# Altium project Mercury_AD_BaseBoard.PrjPcb (part 2 of 4)

## Sheet LTC2666-16.SchDoc
size A; SheetNumber: 20; SheetTotal: 24
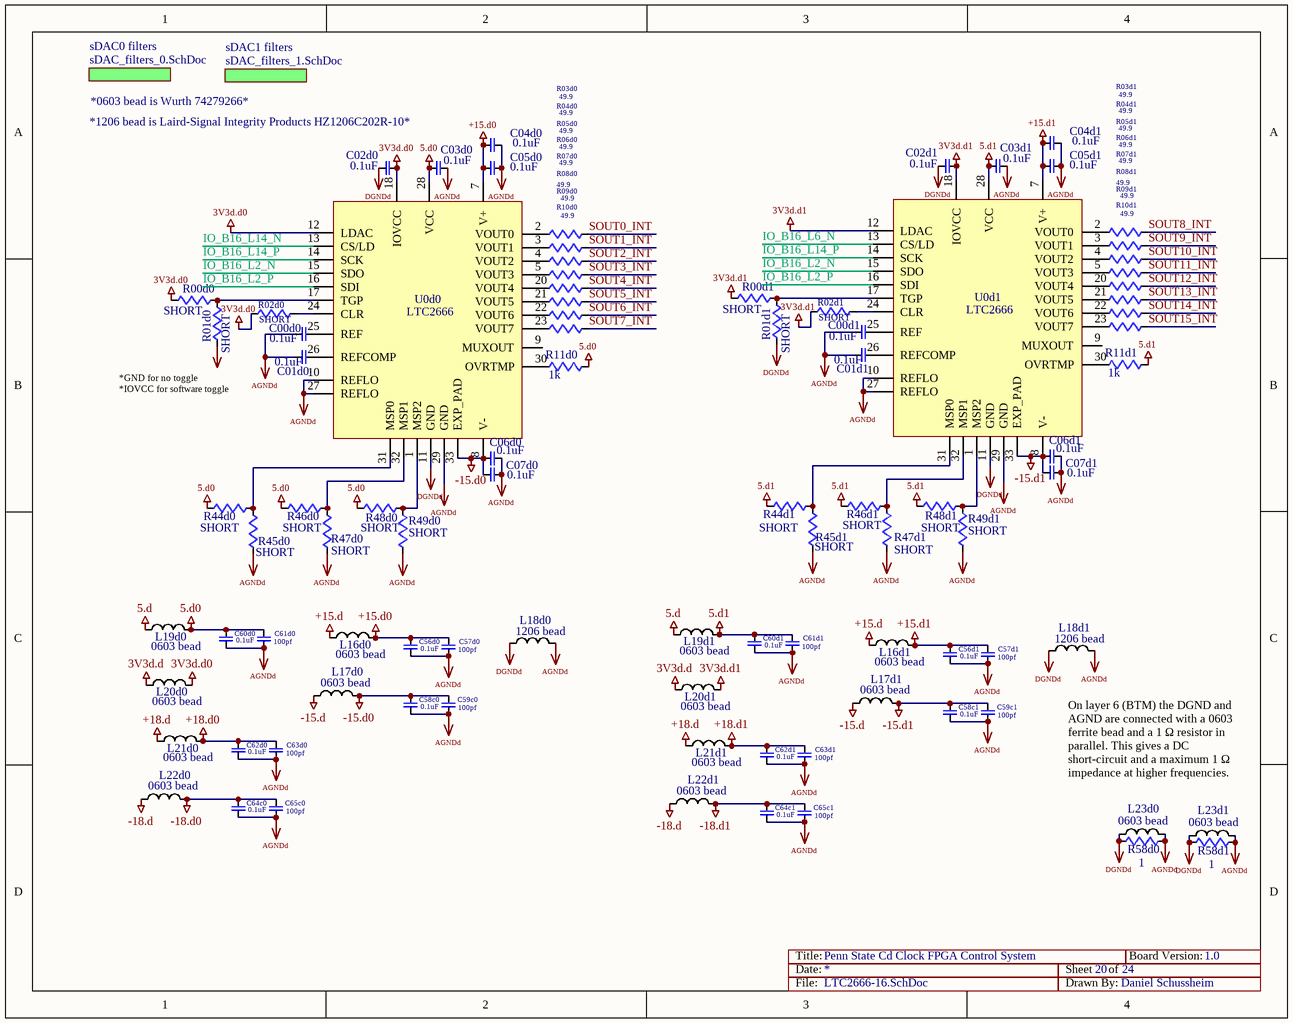
[diagram p9: LTC2666-16.SchDoc]

### Parts
C00d0  0.1uF  [0603]
C00d1  0.1uF  [0603]
C01d0  0.1uF  [0603]
C01d1  0.1uF  [0603]
C02d0  0.1uF  [0603]
C02d1  0.1uF  [0603]
C03d0  0.1uF  [0603]
C03d1  0.1uF  [0603]
C04d0  0.1uF  [0603]
C04d1  0.1uF  [0603]
C05d0  0.1uF  [0603]
C05d1  0.1uF  [0603]
C06d0  0.1uF  [0603]
C06d1  0.1uF  [0603]
C07d0  0.1uF  [0603]
C07d1  0.1uF  [0603]
C56d0  0.1uF  [0603]
C56d1  0.1uF  [0603]
C57d0  100pf  [0603]
C57d1  100pf  [0603]
C58c0  0.1uF  [0603]
C58c1  0.1uF  [0603]
C59c0  100pf  [0603]
C59c1  100pf  [0603]
C60d0  0.1uF  [0603]
C60d1  0.1uF  [0603]
C61d0  100pf  [0603]
C61d1  100pf  [0603]
C62d0  0.1uF  [0603]
C62d1  0.1uF  [0603]
C63d0  100pf  [0603]
C63d1  100pf  [0603]
C64c0  0.1uF  [0603]
C64c1  0.1uF  [0603]
C65c0  100pf  [0603]
C65c1  100pf  [0603]
L16d0  0603 bead  [0603]
L16d1  0603 bead  [0603]
L17d0  0603 bead  [0603]
L17d1  0603 bead  [0603]
L18d0  1206 bead  [1206]
L18d1  1206 bead  [1206]
L19d0  0603 bead  [0603]
L19d1  0603 bead  [0603]
L20d0  0603 bead  [0603]
L20d1  0603 bead  [0603]
L21d0  0603 bead  [0603]
L21d1  0603 bead  [0603]
L22d0  0603 bead  [0603]
L22d1  0603 bead  [0603]
L23d0  0603 bead  [0603]
L23d1  0603 bead  [0603]
R00d0  SHORT  [0603]
R00d1  SHORT  [0603]
R01d0  SHORT  [0603]
R01d1  SHORT  [0603]
R02d0  SHORT  [0603]
R02d1  SHORT  [0603]
R03d0  49.9  [0603]
R03d1  49.9  [0603]
R04d0  49.9  [0603]
R04d1  49.9  [0603]
R05d0  49.9  [0603]
R05d1  49.9  [0603]
R06d0  49.9  [0603]
R06d1  49.9  [0603]
R07d0  49.9  [0603]
R07d1  49.9  [0603]
R08d0  49.9  [0603]
R08d1  49.9  [0603]
R09d0  49.9  [0603]
R09d1  49.9  [0603]
R10d0  49.9  [0603]
R10d1  49.9  [0603]
R11d0  1k  [0603]
R11d1  1k  [0603]
R44d0  SHORT  [0603]
R44d1  SHORT  [0603]
R45d0  SHORT  [0603]
R45d1  SHORT  [0603]
R46d0  SHORT  [0603]
R46d1  SHORT  [0603]
R47d0  SHORT  [0603]
R47d1  SHORT  [0603]
R48d0  SHORT  [0603]
R48d1  SHORT  [0603]
R49d0  SHORT  [0603]
R49d1  SHORT  [0603]
R58d0  1  [0603]
R58d1  1  [0603]
U0d0  LTC2666  [32QFN]
U0d1  LTC2666  [32QFN]

### Sub-sheets
sDAC0 filters = sDAC_filters_0.SchDoc: no entries
sDAC1 filters = sDAC_filters_1.SchDoc: no entries

### Nets
3V3d.d: L20d0.1 L20d1.1
3V3d.d0: C02d0.1 L20d0.2 R00d0.2 R02d0.2 U0d0.12(LDAC) U0d0.18(IOVCC)
3V3d.d1: C02d1.1 L20d1.2 R00d1.2 R02d1.2 U0d1.12(LDAC) U0d1.18(IOVCC)
5.d: L19d0.1 L19d1.1
5.d0: C03d0.2 C60d0.1 C61d0.1 L19d0.2 R11d0.2 R44d0.2 R46d0.2 R48d0.2 U0d0.28(VCC)
5.d1: C03d1.2 C60d1.1 C61d1.1 L19d1.2 R11d1.2 R44d1.2 R46d1.2 R48d1.2 U0d1.28(VCC)
+15.d: L16d0.1 L16d1.1
+15.d0: C04d0.2 C05d0.2 C56d0.1 C57d0.1 L16d0.2 U0d0.7(V+)
+15.d1: C04d1.2 C05d1.2 C56d1.1 C57d1.1 L16d1.2 U0d1.7(V+)
+18.d: L21d0.1 L21d1.1
+18.d0: C62d0.1 C63d0.1 L21d0.2
+18.d1: C62d1.1 C63d1.1 L21d1.2
-15.d: L17d0.1 L17d1.1
-15.d0: C06d0.2 C07d0.2 C58c0.1 C59c0.1 L17d0.2 U0d0.8(V-) U0d0.33(EXP_PAD)
-15.d1: C06d1.2 C07d1.2 C58c1.1 C59c1.1 L17d1.2 U0d1.8(V-) U0d1.33(EXP_PAD)
-18.d: L22d0.1 L22d1.1
-18.d0: C64c0.1 C65c0.1 L22d0.2
-18.d1: C64c1.1 C65c1.1 L22d1.2
AGNDd: C00d0.2 C00d1.2 C01d0.2 C01d1.2 C02d0.2 C02d1.2 C03d0.1 C03d1.1 C04d0.1 C04d1.1 C05d0.1 C05d1.1 C06d0.1 C06d1.1 C07d0.1 C07d1.1 C56d0.2 C56d1.2 C57d0.2 C57d1.2 C58c0.2 C58c1.2 C59c0.2 C59c1.2 C60d0.2 C60d1.2 C61d0.2 C61d1.2 C62d0.2 C62d1.2 C63d0.2 C63d1.2 C64c0.2 C64c1.2 C65c0.2 C65c1.2 L18d0.1 L18d0.2 L18d1.1 L18d1.2 L23d0.1 L23d0.2 L23d1.1 L23d1.2 R01d0.1 R01d1.1 R45d0.2 R45d1.2 R47d0.2 R47d1.2 R49d0.2 R49d1.2 R58d0.1 R58d0.2 R58d1.1 R58d1.2 U0d0.10(REFLO) U0d0.11(GND) U0d0.27(REFLO) U0d0.29(GND) U0d1.10(REFLO) U0d1.11(GND) U0d1.27(REFLO) U0d1.29(GND)  [also labelled DGNDd]  [project net AGNDa]
IO_B16_L2_N: U0d0.15(SDO) U0d1.15(SDO)
IO_B16_L2_P: U0d0.16(SDI) U0d1.16(SDI)
IO_B16_L6_N: U0d1.13(CS/LD)
IO_B16_L14_N: U0d0.13(CS/LD)
IO_B16_L14_P: U0d0.14(SCK) U0d1.14(SCK)
SOUT0_INT: R03d0.2
SOUT1_INT: R04d0.2
SOUT2_INT: R05d0.2
SOUT3_INT: R06d0.2
SOUT4_INT: R07d0.2
SOUT5_INT: R08d0.2
SOUT6_INT: R09d0.2
SOUT7_INT: R10d0.2
SOUT8_INT: R03d1.2
SOUT9_INT: R04d1.2
SOUT10_INT: R05d1.2
SOUT11_INT: R06d1.2
SOUT12_INT: R07d1.2
SOUT13_INT: R08d1.2
SOUT14_INT: R09d1.2
SOUT15_INT: R10d1.2
NetC00d0_1: C00d0.1 U0d0.25(REF)
NetC00d1_1: C00d1.1 U0d1.25(REF)
NetC01d0_1: C01d0.1 U0d0.26(REFCOMP)
NetC01d1_1: C01d1.1 U0d1.26(REFCOMP)
NetR00d0_1: R00d0.1 R01d0.2 U0d0.17(TGP)
NetR00d1_1: R00d1.1 R01d1.2 U0d1.17(TGP)
NetR02d0_1: R02d0.1 U0d0.24(CLR)
NetR02d1_1: R02d1.1 U0d1.24(CLR)
NetR03d0_1: R03d0.1 U0d0.2(VOUT0)
NetR03d1_1: R03d1.1 U0d1.2(VOUT0)
NetR04d0_1: R04d0.1 U0d0.3(VOUT1)
NetR04d1_1: R04d1.1 U0d1.3(VOUT1)
NetR05d0_1: R05d0.1 U0d0.4(VOUT2)
NetR05d1_1: R05d1.1 U0d1.4(VOUT2)
NetR06d0_1: R06d0.1 U0d0.5(VOUT3)
NetR06d1_1: R06d1.1 U0d1.5(VOUT3)
NetR07d0_1: R07d0.1 U0d0.20(VOUT4)
NetR07d1_1: R07d1.1 U0d1.20(VOUT4)
NetR08d0_1: R08d0.1 U0d0.21(VOUT5)
NetR08d1_1: R08d1.1 U0d1.21(VOUT5)
NetR09d0_1: R09d0.1 U0d0.22(VOUT6)
NetR09d1_1: R09d1.1 U0d1.22(VOUT6)
NetR10d0_1: R10d0.1 U0d0.23(VOUT7)
NetR10d1_1: R10d1.1 U0d1.23(VOUT7)
NetR11d0_1: R11d0.1 U0d0.30(OVRTMP)
NetR11d1_1: R11d1.1 U0d1.30(OVRTMP)
NetR44d0_1: R44d0.1 R45d0.1 U0d0.31(MSP0)
NetR44d1_1: R44d1.1 R45d1.1 U0d1.31(MSP0)
NetR46d0_1: R46d0.1 R47d0.1 U0d0.32(MSP1)
NetR46d1_1: R46d1.1 R47d1.1 U0d1.32(MSP1)
NetR48d0_1: R48d0.1 R49d0.1 U0d0.1(MSP2)
NetR48d1_1: R48d1.1 R49d1.1 U0d1.1(MSP2)

Not connected (* = marked no-connect by the designer): U0d0 9(MUXOUT); U0d1 9(MUXOUT)

### Notes on the sheet
- *1206 bead is Laird-Signal Integrity Products HZ1206C202R-10*
- *0603 bead is Wurth 74279266*
- (near R01d0) *GND for no toggle
  *IOVCC for software toggle
- On layer 6 (BTM) the DGND and AGND are connected with a 0603 ferrite bead and a 1 Ω resistor in parallel. This gives a DC short-circuit and a maximum 1 Ω impedance at higher frequencies.
- Title:
- Date:
- Sheet
- of
- Board Version:
- File:
- Drawn By:

### Library data of the parts
C00d0 C00d1 C01d0 C01d1 C02d0 C02d1 C03d0 C03d1 C04d0 C04d1 C05d0 C05d1 C06d0 C06d1 C07d0 C07d1 C56d0 C56d1 C57d0 C57d1 C58c0 C58c1 C59c0 C59c1 C60d0 C60d1 C61d0 C61d1 C62d0 C62d1 C63d0 C63d1 C64c0 C64c1 C65c0 C65c1 = CAP
L16d0 L16d1 L17d0 L17d1 L18d0 L18d1 L19d0 L19d1 L20d0 L20d1 L21d0 L21d1 L22d0 L22d1 L23d0 L23d1 = INDUCTOR
R00d0 R00d1 R01d0 R01d1 R02d0 R02d1 R03d0 R03d1 R04d0 R04d1 R05d0 R05d1 R06d0 R06d1 R07d0 R07d1 R08d0 R08d1 R09d0 R09d1 R10d0 R10d1 R11d0 R11d1 R44d0 R44d1 R45d0 R45d1 R46d0 R46d1 R47d0 R47d1 R48d0 R48d1 R49d0 R49d1 R58d0 R58d1 = RES

## Sheet sDAC_filters_0.SchDoc
size A; SheetNumber: 21; SheetTotal: 24
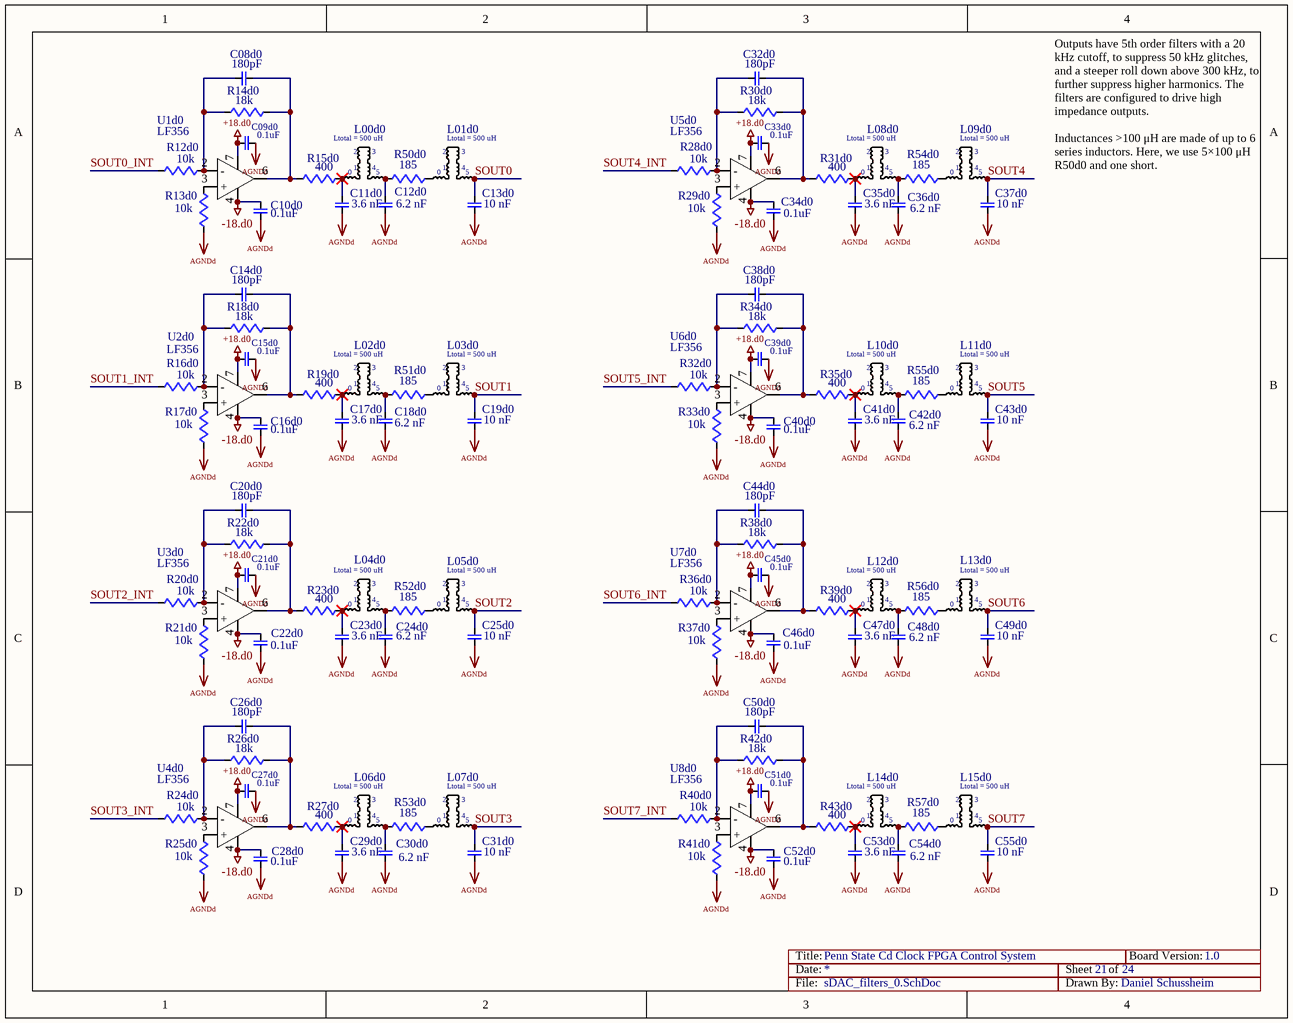
[diagram p10: sDAC_filters_0.SchDoc]

### Parts
C08d0  180pF  [0603]
C09d0  0.1uF  [0603]
C10d0  0.1uF  [0603]
C11d0  3.6 nF  [0603]
C12d0  6.2 nF  [0603]
C13d0  10 nF  [0603]
C14d0  180pF  [0603]
C15d0  0.1uF  [0603]
C16d0  0.1uF  [0603]
C17d0  3.6 nF  [0603]
C18d0  6.2 nF  [0603]
C19d0  10 nF  [0603]
C20d0  180pF  [0603]
C21d0  0.1uF  [0603]
C22d0  0.1uF  [0603]
C23d0  3.6 nF  [0603]
C24d0  6.2 nF  [0603]
C25d0  10 nF  [0603]
C26d0  180pF  [0603]
C27d0  0.1uF  [0603]
C28d0  0.1uF  [0603]
C29d0  3.6 nF  [0603]
C30d0  6.2 nF  [0603]
C31d0  10 nF  [0603]
C32d0  180pF  [0603]
C33d0  0.1uF  [0603]
C34d0  0.1uF  [0603]
C35d0  3.6 nF  [0603]
C36d0  6.2 nF  [0603]
C37d0  10 nF  [0603]
C38d0  180pF  [0603]
C39d0  0.1uF  [0603]
C40d0  0.1uF  [0603]
C41d0  3.6 nF  [0603]
C42d0  6.2 nF  [0603]
C43d0  10 nF  [0603]
C44d0  180pF  [0603]
C45d0  0.1uF  [0603]
C46d0  0.1uF  [0603]
C47d0  3.6 nF  [0603]
C48d0  6.2 nF  [0603]
C49d0  10 nF  [0603]
C50d0  180pF  [0603]
C51d0  0.1uF  [0603]
C52d0  0.1uF  [0603]
C53d0  3.6 nF  [0603]
C54d0  6.2 nF  [0603]
C55d0  10 nF  [0603]
L00d0  Ltotal = 500 uH  [SMT_TOROID_2SIDE]
L01d0  Ltotal = 500 uH  [SMT_TOROID_2SIDE]
L02d0  Ltotal = 500 uH  [SMT_TOROID_2SIDE]
L03d0  Ltotal = 500 uH  [SMT_TOROID_2SIDE]
L04d0  Ltotal = 500 uH  [SMT_TOROID_2SIDE]
L05d0  Ltotal = 500 uH  [SMT_TOROID_2SIDE]
L06d0  Ltotal = 500 uH  [SMT_TOROID_2SIDE]
L07d0  Ltotal = 500 uH  [SMT_TOROID_2SIDE]
L08d0  Ltotal = 500 uH  [SMT_TOROID_2SIDE]
L09d0  Ltotal = 500 uH  [SMT_TOROID_2SIDE]
L10d0  Ltotal = 500 uH  [SMT_TOROID_2SIDE]
L11d0  Ltotal = 500 uH  [SMT_TOROID_2SIDE]
L12d0  Ltotal = 500 uH  [SMT_TOROID_2SIDE]
L13d0  Ltotal = 500 uH  [SMT_TOROID_2SIDE]
L14d0  Ltotal = 500 uH  [SMT_TOROID_2SIDE]
L15d0  Ltotal = 500 uH  [SMT_TOROID_2SIDE]
R12d0  10k  [0603]
R13d0  10k  [0603]
R14d0  18k  [0603]
R15d0  400  [0603]
R16d0  10k  [0603]
R17d0  10k  [0603]
R18d0  18k  [0603]
R19d0  400  [0603]
R20d0  10k  [0603]
R21d0  10k  [0603]
R22d0  18k  [0603]
R23d0  400  [0603]
R24d0  10k  [0603]
R25d0  10k  [0603]
R26d0  18k  [0603]
R27d0  400  [0603]
R28d0  10k  [0603]
R29d0  10k  [0603]
R30d0  18k  [0603]
R31d0  400  [0603]
R32d0  10k  [0603]
R33d0  10k  [0603]
R34d0  18k  [0603]
R35d0  400  [0603]
R36d0  10k  [0603]
R37d0  10k  [0603]
R38d0  18k  [0603]
R39d0  400  [0603]
R40d0  10k  [0603]
R41d0  10k  [0603]
R42d0  18k  [0603]
R43d0  400  [0603]
R50d0  185  [0603]
R51d0  185  [0603]
R52d0  185  [0603]
R53d0  185  [0603]
R54d0  185  [0603]
R55d0  185  [0603]
R56d0  185  [0603]
R57d0  185  [0603]
U1d0  LF356  [8SOIC]
U2d0  LF356  [8SOIC]
U3d0  LF356  [8SOIC]
U4d0  LF356  [8SOIC]
U5d0  LF356  [8SOIC]
U6d0  LF356  [8SOIC]
U7d0  LF356  [8SOIC]
U8d0  LF356  [8SOIC]

### Nets
+18.d0: C09d0.1 C15d0.1 C21d0.1 C27d0.1 C33d0.1 C39d0.1 C45d0.1 C51d0.1 U1d0.7(V+) U2d0.7(V+) U3d0.7(V+) U4d0.7(V+) U5d0.7(V+) U6d0.7(V+) U7d0.7(V+) U8d0.7(V+)
-18.d0: C10d0.1 C16d0.1 C22d0.1 C28d0.1 C34d0.1 C40d0.1 C46d0.1 C52d0.1 U1d0.4(V-) U2d0.4(V-) U3d0.4(V-) U4d0.4(V-) U5d0.4(V-) U6d0.4(V-) U7d0.4(V-) U8d0.4(V-)
AGNDd: C09d0.2 C10d0.2 C11d0.2 C12d0.2 C13d0.2 C15d0.2 C16d0.2 C17d0.2 C18d0.2 C19d0.2 C21d0.2 C22d0.2 C23d0.2 C24d0.2 C25d0.2 C27d0.2 C28d0.2 C29d0.2 C30d0.2 C31d0.2 C33d0.2 C34d0.2 C35d0.2 C36d0.2 C37d0.2 C39d0.2 C40d0.2 C41d0.2 C42d0.2 C43d0.2 C45d0.2 C46d0.2 C47d0.2 C48d0.2 C49d0.2 C51d0.2 C52d0.2 C53d0.2 C54d0.2 C55d0.2 R13d0.1 R17d0.1 R21d0.1 R25d0.1 R29d0.1 R33d0.1 R37d0.1 R41d0.1  [project net AGNDa]
SOUT0: C13d0.1 L01d0.7
SOUT0_INT: R12d0.1
SOUT1: C19d0.1 L03d0.7
SOUT1_INT: R16d0.1
SOUT2: C25d0.1 L05d0.7
SOUT2_INT: R20d0.1
SOUT3: C31d0.1 L07d0.7
SOUT3_INT: R24d0.1
SOUT4: C37d0.1 L09d0.7
SOUT4_INT: R28d0.1
SOUT5: C43d0.1 L11d0.7
SOUT5_INT: R32d0.1
SOUT6: C49d0.1 L13d0.7
SOUT6_INT: R36d0.1
SOUT7: C55d0.1 L15d0.7
SOUT7_INT: R40d0.1
NetC08d0_1: C08d0.1 R14d0.2 R15d0.1 U1d0.6(OUT)
NetC08d0_2: C08d0.2 R12d0.2 R14d0.1 U1d0.2(-)
NetC11d0_1: C11d0.1 L00d0.1 R15d0.2
NetC12d0_1: C12d0.1 L00d0.7 R50d0.1
NetC14d0_1: C14d0.1 R18d0.2 R19d0.1 U2d0.6(OUT)
NetC14d0_2: C14d0.2 R16d0.2 R18d0.1 U2d0.2(-)
NetC17d0_1: C17d0.1 L02d0.1 R19d0.2
NetC18d0_1: C18d0.1 L02d0.7 R51d0.1
NetC20d0_1: C20d0.1 R22d0.2 R23d0.1 U3d0.6(OUT)
NetC20d0_2: C20d0.2 R20d0.2 R22d0.1 U3d0.2(-)
NetC23d0_1: C23d0.1 L04d0.1 R23d0.2
NetC24d0_1: C24d0.1 L04d0.7 R52d0.1
NetC26d0_1: C26d0.1 R26d0.2 R27d0.1 U4d0.6(OUT)
NetC26d0_2: C26d0.2 R24d0.2 R26d0.1 U4d0.2(-)
NetC29d0_1: C29d0.1 L06d0.1 R27d0.2
NetC30d0_1: C30d0.1 L06d0.7 R53d0.1
NetC32d0_1: C32d0.1 R30d0.2 R31d0.1 U5d0.6(OUT)
NetC32d0_2: C32d0.2 R28d0.2 R30d0.1 U5d0.2(-)
NetC35d0_1: C35d0.1 L08d0.1 R31d0.2
NetC36d0_1: C36d0.1 L08d0.7 R54d0.1
NetC38d0_1: C38d0.1 R34d0.2 R35d0.1 U6d0.6(OUT)
NetC38d0_2: C38d0.2 R32d0.2 R34d0.1 U6d0.2(-)
NetC41d0_1: C41d0.1 L10d0.1 R35d0.2
NetC42d0_1: C42d0.1 L10d0.7 R55d0.1
NetC44d0_1: C44d0.1 R38d0.2 R39d0.1 U7d0.6(OUT)
NetC44d0_2: C44d0.2 R36d0.2 R38d0.1 U7d0.2(-)
NetC47d0_1: C47d0.1 L12d0.1 R39d0.2
NetC48d0_1: C48d0.1 L12d0.7 R56d0.1
NetC50d0_1: C50d0.1 R42d0.2 R43d0.1 U8d0.6(OUT)
NetC50d0_2: C50d0.2 R40d0.2 R42d0.1 U8d0.2(-)
NetC53d0_1: C53d0.1 L14d0.1 R43d0.2
NetC54d0_1: C54d0.1 L14d0.7 R57d0.1
NetL01d0_1: L01d0.1 R50d0.2
NetL03d0_1: L03d0.1 R51d0.2
NetL05d0_1: L05d0.1 R52d0.2
NetL07d0_1: L07d0.1 R53d0.2
NetL09d0_1: L09d0.1 R54d0.2
NetL11d0_1: L11d0.1 R55d0.2
NetL13d0_1: L13d0.1 R56d0.2
NetL15d0_1: L15d0.1 R57d0.2
NetR13d0_2: R13d0.2 U1d0.3(+)
NetR17d0_2: R17d0.2 U2d0.3(+)
NetR21d0_2: R21d0.2 U3d0.3(+)
NetR25d0_2: R25d0.2 U4d0.3(+)
NetR29d0_2: R29d0.2 U5d0.3(+)
NetR33d0_2: R33d0.2 U6d0.3(+)
NetR37d0_2: R37d0.2 U7d0.3(+)
NetR41d0_2: R41d0.2 U8d0.3(+)

Not connected (* = marked no-connect by the designer): L00d0 2 3 4 5 6; L01d0 2 3 4 5 6; L02d0 2 3 4 5 6; L03d0 2 3 4 5 6; L04d0 2 3 4 5 6; L05d0 2 3 4 5 6; L06d0 2 3 4 5 6; L07d0 2 3 4 5 6; L08d0 2 3 4 5 6; L09d0 2 3 4 5 6; L10d0 2 3 4 5 6; L11d0 2 3 4 5 6; L12d0 2 3 4 5 6; L13d0 2 3 4 5 6; L14d0 2 3 4 5 6; L15d0 2 3 4 5 6

### Notes on the sheet
- Outputs have 5th order filters with a 20 kHz cutoff, to suppress 50 kHz glitches, and a steeper roll down above 300 kHz, to further suppress higher harmonics. The filters are configured to drive high impedance outputs.
  Inductances >100 μH are made of up to 6 series inductors. Here, we use 5×100 μH R50d0 and one short.
- Title:
- Date:
- Sheet
- of
- Board Version:
- File:
- Drawn By:
- Title
- Size:
- A3
- Number:
- Time:
- Revision:
- (in symbol SMT_TOROID_2SIDE) 0

### Library data of the parts
C08d0 C09d0 C10d0 C11d0 C12d0 C13d0 C14d0 C15d0 C16d0 C17d0 C18d0 C19d0 C20d0 C21d0 C22d0 C23d0 C24d0 C25d0 C26d0 C27d0 C28d0 C29d0 C30d0 C31d0 C32d0 C33d0 C34d0 C35d0 C36d0 C37d0 C38d0 C39d0 C40d0 C41d0 C42d0 C43d0 C44d0 C45d0 C46d0 C47d0 C48d0 C49d0 C50d0 C51d0 C52d0 C53d0 C54d0 C55d0 = CAP
L00d0 L01d0 L02d0 L03d0 L04d0 L05d0 L06d0 L07d0 L08d0 L09d0 L10d0 L11d0 L12d0 L13d0 L14d0 L15d0 = SMT_TOROID_2SIDE
R12d0 R13d0 R14d0 R15d0 R16d0 R17d0 R18d0 R19d0 R20d0 R21d0 R22d0 R23d0 R24d0 R25d0 R26d0 R27d0 R28d0 R29d0 R30d0 R31d0 R32d0 R33d0 R34d0 R35d0 R36d0 R37d0 R38d0 R39d0 R40d0 R41d0 R42d0 R43d0 R50d0 R51d0 R52d0 R53d0 R54d0 R55d0 R56d0 R57d0 = RES

## Sheet sDAC_filters_1.SchDoc
size A; SheetNumber: 22; SheetTotal: 24
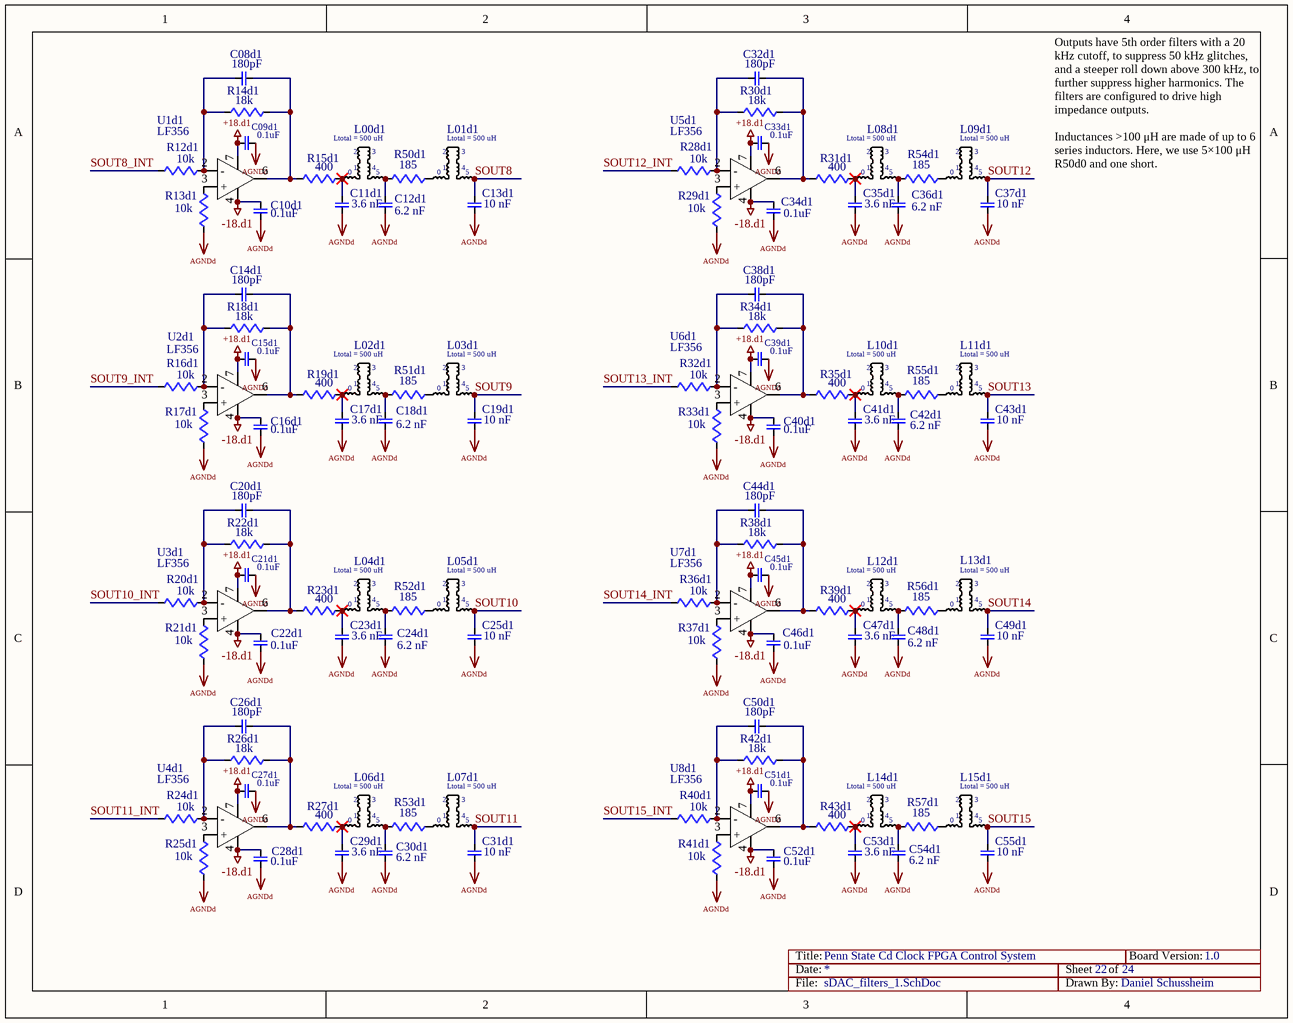
[diagram p11: sDAC_filters_1.SchDoc]

### Parts
C08d1  180pF  [0603]
C09d1  0.1uF  [0603]
C10d1  0.1uF  [0603]
C11d1  3.6 nF  [0603]
C12d1  6.2 nF  [0603]
C13d1  10 nF  [0603]
C14d1  180pF  [0603]
C15d1  0.1uF  [0603]
C16d1  0.1uF  [0603]
C17d1  3.6 nF  [0603]
C18d1  6.2 nF  [0603]
C19d1  10 nF  [0603]
C20d1  180pF  [0603]
C21d1  0.1uF  [0603]
C22d1  0.1uF  [0603]
C23d1  3.6 nF  [0603]
C24d1  6.2 nF  [0603]
C25d1  10 nF  [0603]
C26d1  180pF  [0603]
C27d1  0.1uF  [0603]
C28d1  0.1uF  [0603]
C29d1  3.6 nF  [0603]
C30d1  6.2 nF  [0603]
C31d1  10 nF  [0603]
C32d1  180pF  [0603]
C33d1  0.1uF  [0603]
C34d1  0.1uF  [0603]
C35d1  3.6 nF  [0603]
C36d1  6.2 nF  [0603]
C37d1  10 nF  [0603]
C38d1  180pF  [0603]
C39d1  0.1uF  [0603]
C40d1  0.1uF  [0603]
C41d1  3.6 nF  [0603]
C42d1  6.2 nF  [0603]
C43d1  10 nF  [0603]
C44d1  180pF  [0603]
C45d1  0.1uF  [0603]
C46d1  0.1uF  [0603]
C47d1  3.6 nF  [0603]
C48d1  6.2 nF  [0603]
C49d1  10 nF  [0603]
C50d1  180pF  [0603]
C51d1  0.1uF  [0603]
C52d1  0.1uF  [0603]
C53d1  3.6 nF  [0603]
C54d1  6.2 nF  [0603]
C55d1  10 nF  [0603]
L00d1  Ltotal = 500 uH  [SMT_TOROID_2SIDE]
L01d1  Ltotal = 500 uH  [SMT_TOROID_2SIDE]
L02d1  Ltotal = 500 uH  [SMT_TOROID_2SIDE]
L03d1  Ltotal = 500 uH  [SMT_TOROID_2SIDE]
L04d1  Ltotal = 500 uH  [SMT_TOROID_2SIDE]
L05d1  Ltotal = 500 uH  [SMT_TOROID_2SIDE]
L06d1  Ltotal = 500 uH  [SMT_TOROID_2SIDE]
L07d1  Ltotal = 500 uH  [SMT_TOROID_2SIDE]
L08d1  Ltotal = 500 uH  [SMT_TOROID_2SIDE]
L09d1  Ltotal = 500 uH  [SMT_TOROID_2SIDE]
L10d1  Ltotal = 500 uH  [SMT_TOROID_2SIDE]
L11d1  Ltotal = 500 uH  [SMT_TOROID_2SIDE]
L12d1  Ltotal = 500 uH  [SMT_TOROID_2SIDE]
L13d1  Ltotal = 500 uH  [SMT_TOROID_2SIDE]
L14d1  Ltotal = 500 uH  [SMT_TOROID_2SIDE]
L15d1  Ltotal = 500 uH  [SMT_TOROID_2SIDE]
R12d1  10k  [0603]
R13d1  10k  [0603]
R14d1  18k  [0603]
R15d1  400  [0603]
R16d1  10k  [0603]
R17d1  10k  [0603]
R18d1  18k  [0603]
R19d1  400  [0603]
R20d1  10k  [0603]
R21d1  10k  [0603]
R22d1  18k  [0603]
R23d1  400  [0603]
R24d1  10k  [0603]
R25d1  10k  [0603]
R26d1  18k  [0603]
R27d1  400  [0603]
R28d1  10k  [0603]
R29d1  10k  [0603]
R30d1  18k  [0603]
R31d1  400  [0603]
R32d1  10k  [0603]
R33d1  10k  [0603]
R34d1  18k  [0603]
R35d1  400  [0603]
R36d1  10k  [0603]
R37d1  10k  [0603]
R38d1  18k  [0603]
R39d1  400  [0603]
R40d1  10k  [0603]
R41d1  10k  [0603]
R42d1  18k  [0603]
R43d1  400  [0603]
R50d1  185  [0603]
R51d1  185  [0603]
R52d1  185  [0603]
R53d1  185  [0603]
R54d1  185  [0603]
R55d1  185  [0603]
R56d1  185  [0603]
R57d1  185  [0603]
U1d1  LF356  [8SOIC]
U2d1  LF356  [8SOIC]
U3d1  LF356  [8SOIC]
U4d1  LF356  [8SOIC]
U5d1  LF356  [8SOIC]
U6d1  LF356  [8SOIC]
U7d1  LF356  [8SOIC]
U8d1  LF356  [8SOIC]

### Nets
+18.d1: C09d1.1 C15d1.1 C21d1.1 C27d1.1 C33d1.1 C39d1.1 C45d1.1 C51d1.1 U1d1.7(V+) U2d1.7(V+) U3d1.7(V+) U4d1.7(V+) U5d1.7(V+) U6d1.7(V+) U7d1.7(V+) U8d1.7(V+)
-18.d1: C10d1.1 C16d1.1 C22d1.1 C28d1.1 C34d1.1 C40d1.1 C46d1.1 C52d1.1 U1d1.4(V-) U2d1.4(V-) U3d1.4(V-) U4d1.4(V-) U5d1.4(V-) U6d1.4(V-) U7d1.4(V-) U8d1.4(V-)
AGNDd: C09d1.2 C10d1.2 C11d1.2 C12d1.2 C13d1.2 C15d1.2 C16d1.2 C17d1.2 C18d1.2 C19d1.2 C21d1.2 C22d1.2 C23d1.2 C24d1.2 C25d1.2 C27d1.2 C28d1.2 C29d1.2 C30d1.2 C31d1.2 C33d1.2 C34d1.2 C35d1.2 C36d1.2 C37d1.2 C39d1.2 C40d1.2 C41d1.2 C42d1.2 C43d1.2 C45d1.2 C46d1.2 C47d1.2 C48d1.2 C49d1.2 C51d1.2 C52d1.2 C53d1.2 C54d1.2 C55d1.2 R13d1.1 R17d1.1 R21d1.1 R25d1.1 R29d1.1 R33d1.1 R37d1.1 R41d1.1  [project net AGNDa]
SOUT8: C13d1.1 L01d1.7
SOUT8_INT: R12d1.1
SOUT9: C19d1.1 L03d1.7
SOUT9_INT: R16d1.1
SOUT10: C25d1.1 L05d1.7
SOUT10_INT: R20d1.1
SOUT11: C31d1.1 L07d1.7
SOUT11_INT: R24d1.1
SOUT12: C37d1.1 L09d1.7
SOUT12_INT: R28d1.1
SOUT13: C43d1.1 L11d1.7
SOUT13_INT: R32d1.1
SOUT14: C49d1.1 L13d1.7
SOUT14_INT: R36d1.1
SOUT15: C55d1.1 L15d1.7
SOUT15_INT: R40d1.1
NetC08d1_1: C08d1.1 R14d1.2 R15d1.1 U1d1.6(OUT)
NetC08d1_2: C08d1.2 R12d1.2 R14d1.1 U1d1.2(-)
NetC11d1_1: C11d1.1 L00d1.1 R15d1.2
NetC12d1_1: C12d1.1 L00d1.7 R50d1.1
NetC14d1_1: C14d1.1 R18d1.2 R19d1.1 U2d1.6(OUT)
NetC14d1_2: C14d1.2 R16d1.2 R18d1.1 U2d1.2(-)
NetC17d1_1: C17d1.1 L02d1.1 R19d1.2
NetC18d1_1: C18d1.1 L02d1.7 R51d1.1
NetC20d1_1: C20d1.1 R22d1.2 R23d1.1 U3d1.6(OUT)
NetC20d1_2: C20d1.2 R20d1.2 R22d1.1 U3d1.2(-)
NetC23d1_1: C23d1.1 L04d1.1 R23d1.2
NetC24d1_1: C24d1.1 L04d1.7 R52d1.1
NetC26d1_1: C26d1.1 R26d1.2 R27d1.1 U4d1.6(OUT)
NetC26d1_2: C26d1.2 R24d1.2 R26d1.1 U4d1.2(-)
NetC29d1_1: C29d1.1 L06d1.1 R27d1.2
NetC30d1_1: C30d1.1 L06d1.7 R53d1.1
NetC32d1_1: C32d1.1 R30d1.2 R31d1.1 U5d1.6(OUT)
NetC32d1_2: C32d1.2 R28d1.2 R30d1.1 U5d1.2(-)
NetC35d1_1: C35d1.1 L08d1.1 R31d1.2
NetC36d1_1: C36d1.1 L08d1.7 R54d1.1
NetC38d1_1: C38d1.1 R34d1.2 R35d1.1 U6d1.6(OUT)
NetC38d1_2: C38d1.2 R32d1.2 R34d1.1 U6d1.2(-)
NetC41d1_1: C41d1.1 L10d1.1 R35d1.2
NetC42d1_1: C42d1.1 L10d1.7 R55d1.1
NetC44d1_1: C44d1.1 R38d1.2 R39d1.1 U7d1.6(OUT)
NetC44d1_2: C44d1.2 R36d1.2 R38d1.1 U7d1.2(-)
NetC47d1_1: C47d1.1 L12d1.1 R39d1.2
NetC48d1_1: C48d1.1 L12d1.7 R56d1.1
NetC50d1_1: C50d1.1 R42d1.2 R43d1.1 U8d1.6(OUT)
NetC50d1_2: C50d1.2 R40d1.2 R42d1.1 U8d1.2(-)
NetC53d1_1: C53d1.1 L14d1.1 R43d1.2
NetC54d1_1: C54d1.1 L14d1.7 R57d1.1
NetL01d1_1: L01d1.1 R50d1.2
NetL03d1_1: L03d1.1 R51d1.2
NetL05d1_1: L05d1.1 R52d1.2
NetL07d1_1: L07d1.1 R53d1.2
NetL09d1_1: L09d1.1 R54d1.2
NetL11d1_1: L11d1.1 R55d1.2
NetL13d1_1: L13d1.1 R56d1.2
NetL15d1_1: L15d1.1 R57d1.2
NetR13d1_2: R13d1.2 U1d1.3(+)
NetR17d1_2: R17d1.2 U2d1.3(+)
NetR21d1_2: R21d1.2 U3d1.3(+)
NetR25d1_2: R25d1.2 U4d1.3(+)
NetR29d1_2: R29d1.2 U5d1.3(+)
NetR33d1_2: R33d1.2 U6d1.3(+)
NetR37d1_2: R37d1.2 U7d1.3(+)
NetR41d1_2: R41d1.2 U8d1.3(+)

Not connected (* = marked no-connect by the designer): L00d1 2 3 4 5 6; L01d1 2 3 4 5 6; L02d1 2 3 4 5 6; L03d1 2 3 4 5 6; L04d1 2 3 4 5 6; L05d1 2 3 4 5 6; L06d1 2 3 4 5 6; L07d1 2 3 4 5 6; L08d1 2 3 4 5 6; L09d1 2 3 4 5 6; L10d1 2 3 4 5 6; L11d1 2 3 4 5 6; L12d1 2 3 4 5 6; L13d1 2 3 4 5 6; L14d1 2 3 4 5 6; L15d1 2 3 4 5 6

### Notes on the sheet
- Outputs have 5th order filters with a 20 kHz cutoff, to suppress 50 kHz glitches, and a steeper roll down above 300 kHz, to further suppress higher harmonics. The filters are configured to drive high impedance outputs.
  Inductances >100 μH are made of up to 6 series inductors. Here, we use 5×100 μH R50d0 and one short.
- Title:
- Date:
- Sheet
- of
- Board Version:
- File:
- Drawn By:
- Title
- Size:
- A3
- Number:
- Time:
- Revision:
- (in symbol SMT_TOROID_2SIDE) 0

### Library data of the parts
C08d1 C09d1 C10d1 C11d1 C12d1 C13d1 C14d1 C15d1 C16d1 C17d1 C18d1 C19d1 C20d1 C21d1 C22d1 C23d1 C24d1 C25d1 C26d1 C27d1 C28d1 C29d1 C30d1 C31d1 C32d1 C33d1 C34d1 C35d1 C36d1 C37d1 C38d1 C39d1 C40d1 C41d1 C42d1 C43d1 C44d1 C45d1 C46d1 C47d1 C48d1 C49d1 C50d1 C51d1 C52d1 C53d1 C54d1 C55d1 = CAP
L00d1 L01d1 L02d1 L03d1 L04d1 L05d1 L06d1 L07d1 L08d1 L09d1 L10d1 L11d1 L12d1 L13d1 L14d1 L15d1 = SMT_TOROID_2SIDE
R12d1 R13d1 R14d1 R15d1 R16d1 R17d1 R18d1 R19d1 R20d1 R21d1 R22d1 R23d1 R24d1 R25d1 R26d1 R27d1 R28d1 R29d1 R30d1 R31d1 R32d1 R33d1 R34d1 R35d1 R36d1 R37d1 R38d1 R39d1 R40d1 R41d1 R42d1 R43d1 R50d1 R51d1 R52d1 R53d1 R54d1 R55d1 R56d1 R57d1 = RES

## Sheet LTC2335-16_0.SchDoc
size A; SheetNumber: 10; SheetTotal: 24
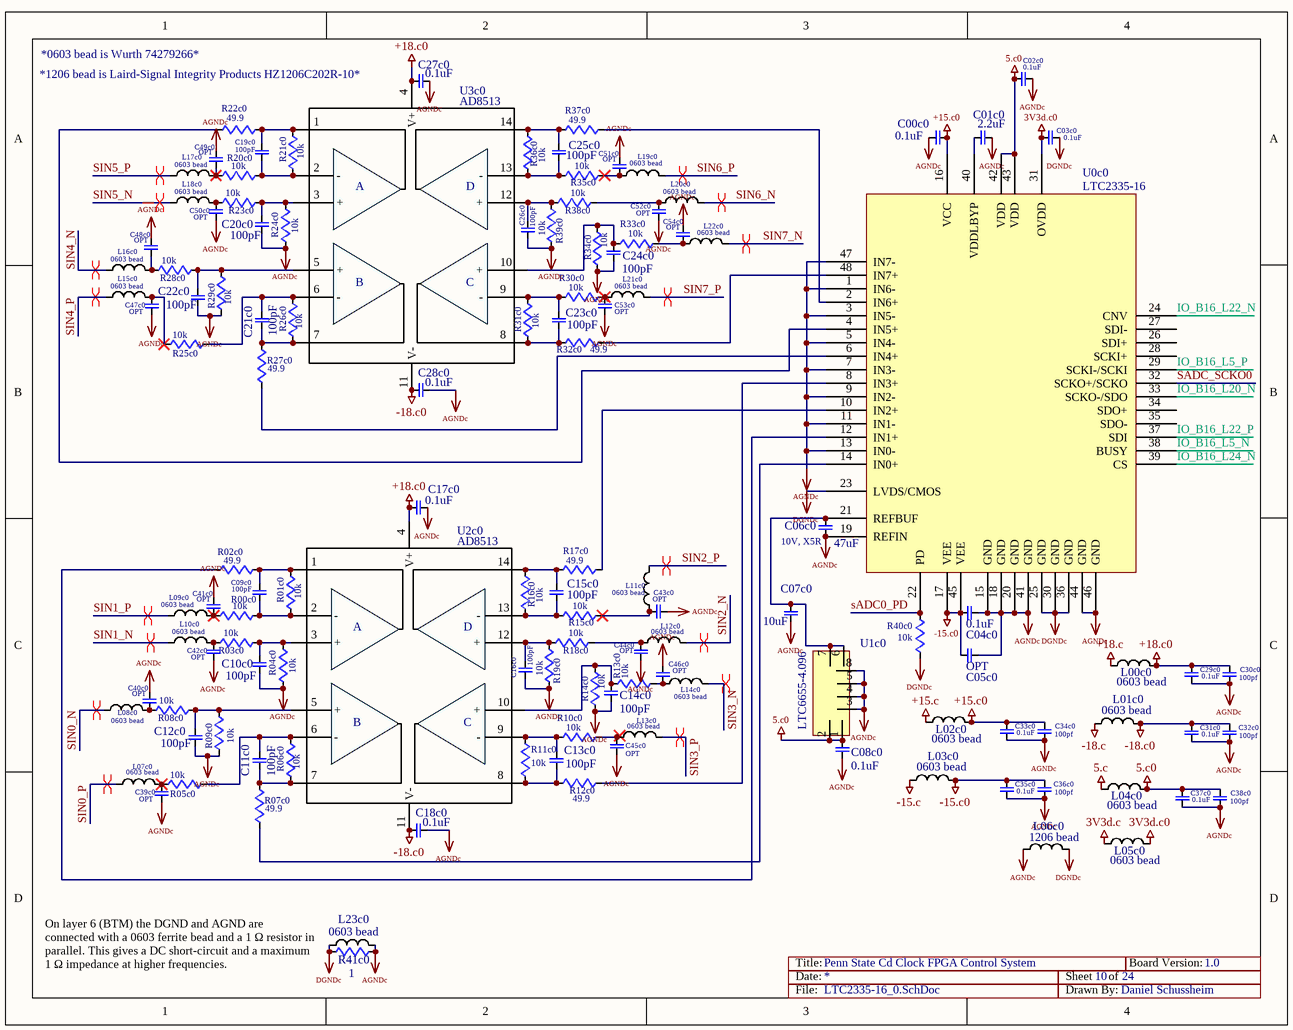
[diagram p12: LTC2335-16_0.SchDoc]

### Parts
C00c0  0.1uF  [0603]
C01c0  2.2uF  [0603]
C02c0  0.1uF  [0603]
C03c0  0.1uF  [0603]
C04c0  0.1uF  [0603]
C05c0  OPT  [0603]
C06c0  47uF  [1210]
C07c0  10uF  [0805]
C08c0  0.1uF  [0603]
C09c0  100pF  [0603]
C10c0  100pF  [0603]
C11c0  100pF  [0603]
C12c0  100pF  [0603]
C13c0  100pF  [0603]
C14c0  100pF  [0603]
C15c0  100pF  [0603]
C16c0  100pF  [0603]
C17c0  0.1uF  [0603]
C18c0  0.1uF  [0603]
C19c0  100pF  [0603]
C20c0  100pF  [0603]
C21c0  100pF  [0603]
C22c0  100pF  [0603]
C23c0  100pF  [0603]
C24c0  100pF  [0603]
C25c0  100pF  [0603]
C26c0  100pF  [0603]
C27c0  0.1uF  [0603]
C28c0  0.1uF  [0603]
C29c0  0.1uF  [0603]
C30c0  100pf  [0603]
C31c0  0.1uF  [0603]
C32c0  100pf  [0603]
C33c0  0.1uF  [0603]
C34c0  100pf  [0603]
C35c0  0.1uF  [0603]
C36c0  100pf  [0603]
C37c0  0.1uF  [0603]
C38c0  100pf  [0603]
C39c0  OPT  [0603]
C40c0  OPT  [0603]
C41c0  OPT  [0603]
C42c0  OPT  [0603]
C43c0  OPT  [0603]
C44c0  OPT  [0603]
C45c0  OPT  [0603]
C46c0  OPT  [0603]
C47c0  OPT  [0603]
C48c0  OPT  [0603]
C49c0  OPT  [0603]
C50c0  OPT  [0603]
C51c0  OPT  [0603]
C52c0  OPT  [0603]
C53c0  OPT  [0603]
C54c0  OPT  [0603]
L00c0  0603 bead  [0603]
L01c0  0603 bead  [0603]
L02c0  0603 bead  [0603]
L03c0  0603 bead  [0603]
L04c0  0603 bead  [0603]
L05c0  0603 bead  [0603]
L06c0  1206 bead  [1206]
L07c0  0603 bead  [0603]
L08c0  0603 bead  [0603]
L09c0  0603 bead  [0603]
L10c0  0603 bead  [0603]
L11c0  0603 bead  [0603]
L12c0  0603 bead  [0603]
L13c0  0603 bead  [0603]
L14c0  0603 bead  [0603]
L15c0  0603 bead  [0603]
L16c0  0603 bead  [0603]
L17c0  0603 bead  [0603]
L18c0  0603 bead  [0603]
L19c0  0603 bead  [0603]
L20c0  0603 bead  [0603]
L21c0  0603 bead  [0603]
L22c0  0603 bead  [0603]
L23c0  0603 bead  [0603]
R00c0  10k  [0603]
R01c0  10k  [0603]
R02c0  49.9  [0603]
R03c0  10k  [0603]
R04c0  10k  [0603]
R05c0  10k  [0603]
R06c0  10k  [0603]
R07c0  49.9  [0603]
R08c0  10k  [0603]
R09c0  10k  [0603]
R10c0  10k  [0603]
R11c0  10k  [0603]
R12c0  49.9  [0603]
R13c0  10k  [0603]
R14c0  10k  [0603]
R15c0  10k  [0603]
R16c0  10k  [0603]
R17c0  49.9  [0603]
R18c0  10k  [0603]
R19c0  10k  [0603]
R20c0  10k  [0603]
R21c0  10k  [0603]
R22c0  49.9  [0603]
R23c0  10k  [0603]
R24c0  10k  [0603]
R25c0  10k  [0603]
R26c0  10k  [0603]
R27c0  49.9  [0603]
R28c0  10k  [0603]
R29c0  10k  [0603]
R30c0  10k  [0603]
R31c0  10k  [0603]
R32c0  49.9  [0603]
R33c0  10k  [0603]
R34c0  10k  [0603]
R35c0  10k  [0603]
R36c0  10k  [0603]
R37c0  49.9  [0603]
R38c0  10k  [0603]
R39c0  10k  [0603]
R40c0  10k  [0603]
R41c0  1  [0603]
U0c0  LTC2335-16  [48LQFP]
U1c0  LTC6655-4.096  [8MSOP_1]
U2c0  AD8513  [14TSSOP]
U3c0  AD8513  [14TSSOP]

### Nets
3V3d.c: L05c0.1
3V3d.c0: C03c0.2 L05c0.2 U0c0.31(OVDD)
5.c: L04c0.1
5.c0: C02c0.2 C08c0.2 C37c0.1 C38c0.1 L04c0.2 U0c0.42(VDD) U0c0.43(VDD) U1c0.1(SHDN) U1c0.2(VIN)
+15.c: L02c0.1
+15.c0: C00c0.1 C33c0.1 C34c0.1 L02c0.2 U0c0.16(VCC)
+18.c: L00c0.1
+18.c0: C17c0.2 C27c0.2 C29c0.1 C30c0.1 L00c0.2 U2c0.4(V+) U3c0.4(V+)
-15.c: L03c0.1
-15.c0: C04c0.2 C05c0.2 C35c0.1 C36c0.1 L03c0.2 U0c0.17(VEE) U0c0.45(VEE)
-18.c: L01c0.1
-18.c0: C18c0.2 C28c0.2 C31c0.1 C32c0.1 L01c0.2 U2c0.11(V-) U3c0.11(V-)
AGNDc: C00c0.2 C01c0.1 C02c0.1 C03c0.1 C04c0.1 C05c0.1 C06c0.1 C07c0.1 C08c0.1 C10c0.2 C12c0.2 C14c0.2 C16c0.2 C17c0.1 C18c0.1 C20c0.2 C22c0.2 C24c0.1 C26c0.2 C27c0.1 C28c0.1 C29c0.2 C30c0.2 C31c0.2 C32c0.2 C33c0.2 C34c0.2 C35c0.2 C36c0.2 C37c0.2 C38c0.2 C39c0.2 C40c0.1 C41c0.1 C42c0.2 C43c0.1 C44c0.1 C45c0.1 C46c0.1 C47c0.2 C48c0.1 C49c0.1 C50c0.2 C51c0.1 C52c0.2 C53c0.2 C54c0.1 L06c0.1 L06c0.2 L23c0.1 L23c0.2 R04c0.1 R09c0.1 R14c0.1 R19c0.1 R24c0.1 R29c0.1 R34c0.1 R39c0.1 R40c0.1 R41c0.1 R41c0.2 U0c0.1(IN6-) U0c0.3(IN5-) U0c0.5(IN4-) U0c0.7(IN3-) U0c0.9(IN2-) U0c0.11(IN1-) U0c0.13(IN0-) U0c0.15(GND) U0c0.18(GND) U0c0.19(REFIN) U0c0.20(GND) U0c0.23(LVDS/CMOS) U0c0.25(GND) U0c0.30(GND) U0c0.36(GND) U0c0.41(GND) U0c0.44(GND) U0c0.46(GND) U0c0.47(IN7-) U1c0.3(GND) U1c0.4(GND) U1c0.5(GND) U1c0.8(GND)  [also labelled DGNDc]  [project net AGNDa]
IO_B16_L5_N: U0c0.38(BUSY)
IO_B16_L5_P: U0c0.29(SCKI-/SCKI)
IO_B16_L20_N: U0c0.33(SCKO-/SDO)
IO_B16_L22_N: U0c0.24(CNV)
IO_B16_L22_P: U0c0.37(SDI)
IO_B16_L24_N: U0c0.39(CS)
sADC0_PD: R40c0.2 U0c0.22(PD)
SADC_SCKO0: U0c0.32(SCKO+/SCKO)
SIN0_N: L08c0.1
SIN0_P: L07c0.1
SIN1_N: L10c0.1
SIN1_P: L09c0.1
SIN2_N: L12c0.2
SIN2_P: L11c0.2
SIN3_N: L14c0.2
SIN3_P: L13c0.2
SIN4_N: L16c0.1
SIN4_P: L15c0.1
SIN5_N: L18c0.1
SIN5_P: L17c0.1
SIN6_N: L20c0.2
SIN6_P: L19c0.2
SIN7_N: L22c0.2
SIN7_P: L21c0.2
NetC01c0_2: C01c0.2 U0c0.40(VDDLBYP)
NetC06c0_2: C06c0.2 C07c0.2 U0c0.21(REFBUF) U1c0.6(VOUT_S) U1c0.7(VOUT_F)
NetC09c0_1: C09c0.1 R01c0.2 R02c0.2 U2c0.1(OUTA)
NetC09c0_2: C09c0.2 R00c0.2 R01c0.1 U2c0.2(-)
NetC10c0_1: C10c0.1 R03c0.2 R04c0.2 U2c0.3(+)
NetC11c0_1: C11c0.1 R06c0.1 R07c0.2 U2c0.7(OUTB)
NetC11c0_2: C11c0.2 R05c0.1 R06c0.2 U2c0.6(-)
NetC12c0_1: C12c0.1 R08c0.2 R09c0.2 U2c0.5(+)
NetC13c0_1: C13c0.1 R11c0.1 R12c0.1 U2c0.8(OUTB)
NetC13c0_2: C13c0.2 R10c0.1 R11c0.2 U2c0.9(-)
NetC14c0_1: C14c0.1 R13c0.1 R14c0.2 U2c0.10(+)
NetC15c0_1: C15c0.1 R16c0.2 R17c0.1 U2c0.14(OUTA)
NetC15c0_2: C15c0.2 R15c0.1 R16c0.1 U2c0.13(-)
NetC16c0_1: C16c0.1 R18c0.1 R19c0.2 U2c0.12(+)
NetC19c0_1: C19c0.1 R21c0.2 R22c0.2 U3c0.1(OUTA)
NetC19c0_2: C19c0.2 R20c0.2 R21c0.1 U3c0.2(-)
NetC20c0_1: C20c0.1 R23c0.2 R24c0.2 U3c0.3(+)
NetC21c0_1: C21c0.1 R26c0.1 R27c0.2 U3c0.7(OUTB)
NetC21c0_2: C21c0.2 R25c0.1 R26c0.2 U3c0.6(-)
NetC22c0_1: C22c0.1 R28c0.2 R29c0.2 U3c0.5(+)
NetC23c0_1: C23c0.1 R31c0.1 R32c0.1 U3c0.8(OUTB)
NetC23c0_2: C23c0.2 R30c0.1 R31c0.2 U3c0.9(-)
NetC24c0_2: C24c0.2 R33c0.1 R34c0.2 U3c0.10(+)
NetC25c0_1: C25c0.1 R36c0.2 R37c0.1 U3c0.14(OUTA)
NetC25c0_2: C25c0.2 R35c0.1 R36c0.1 U3c0.13(-)
NetC26c0_1: C26c0.1 R38c0.1 R39c0.2 U3c0.12(+)
NetC39c0_1: C39c0.1 L07c0.2 R05c0.2
NetC40c0_2: C40c0.2 L08c0.2 R08c0.1
NetC41c0_2: C41c0.2 L09c0.2 R00c0.1
NetC42c0_1: C42c0.1 L10c0.2 R03c0.1
NetC43c0_2: C43c0.2 L11c0.1 R15c0.2
NetC44c0_2: C44c0.2 L12c0.1 R18c0.2
NetC45c0_2: C45c0.2 L13c0.1 R10c0.2
NetC46c0_2: C46c0.2 L14c0.1 R13c0.2
NetC47c0_1: C47c0.1 L15c0.2 R25c0.2
NetC48c0_2: C48c0.2 L16c0.2 R28c0.1
NetC49c0_2: C49c0.2 L17c0.2 R20c0.1
NetC50c0_1: C50c0.1 L18c0.2 R23c0.1
NetC51c0_2: C51c0.2 L19c0.1 R35c0.2
NetC52c0_1: C52c0.1 L20c0.1 R38c0.2
NetC53c0_1: C53c0.1 L21c0.1 R30c0.2
NetC54c0_2: C54c0.2 L22c0.1 R33c0.2
NetR02c0_1: R02c0.1 U0c0.12(IN1+)
NetR07c0_1: R07c0.1 U0c0.14(IN0+)
NetR12c0_2: R12c0.2 U0c0.8(IN3+)
NetR17c0_2: R17c0.2 U0c0.10(IN2+)
NetR22c0_1: R22c0.1 U0c0.4(IN5+)
NetR27c0_1: R27c0.1 U0c0.6(IN4+)
NetR32c0_2: R32c0.2 U0c0.48(IN7+)
NetR37c0_2: R37c0.2 U0c0.2(IN6+)

Not connected (* = marked no-connect by the designer): U0c0 26(SDI+) 27(SDI-) 28(SCKI+) 34(SDO+) 35(SDO-)

### Layout directives
differential pair: SIN0_N, SIN0_P, SIN1_N, SIN1_P, SIN2_N, SIN2_P, SIN3_N, SIN3_P, SIN4_N, SIN4_P, SIN5_N, SIN5_P, SIN6_N, SIN6_P, SIN7_N, SIN7_P

### Notes on the sheet
- (near C27c0) *1206 bead is Laird-Signal Integrity Products HZ1206C202R-10*
- *0603 bead is Wurth 74279266*
- (near C06c0) 10V, X5R
- On layer 6 (BTM) the DGND and AGND are connected with a 0603 ferrite bead and a 1 Ω resistor in parallel. This gives a DC short-circuit and a maximum 1 Ω impedance at higher frequencies.
- Title:
- Date:
- Sheet
- of
- Board Version:
- File:
- Drawn By:
- (in symbol OPAMPx4) A; D; B; C

### Library data of the parts
C00c0 C01c0 C02c0 C03c0 C04c0 C05c0 C06c0 C07c0 C08c0 C09c0 C10c0 C11c0 C12c0 C13c0 C14c0 C15c0 C16c0 C17c0 C18c0 C19c0 C20c0 C21c0 C22c0 C23c0 C24c0 C25c0 C26c0 C27c0 C28c0 C29c0 C30c0 C31c0 C32c0 C33c0 C34c0 C35c0 C36c0 C37c0 C38c0 C39c0 C40c0 C41c0 C42c0 C43c0 C44c0 C45c0 C46c0 C47c0 C48c0 C49c0 C50c0 C51c0 C52c0 C53c0 C54c0 = CAP
L00c0 L01c0 L02c0 L03c0 L04c0 L05c0 L06c0 L07c0 L08c0 L09c0 L10c0 L11c0 L12c0 L13c0 L14c0 L15c0 L16c0 L17c0 L18c0 L19c0 L20c0 L21c0 L22c0 L23c0 = INDUCTOR
R00c0 R01c0 R02c0 R03c0 R04c0 R05c0 R06c0 R07c0 R08c0 R09c0 R10c0 R11c0 R12c0 R13c0 R14c0 R15c0 R16c0 R17c0 R18c0 R19c0 R20c0 R21c0 R22c0 R23c0 R24c0 R25c0 R26c0 R27c0 R28c0 R29c0 R30c0 R31c0 R32c0 R33c0 R34c0 R35c0 R36c0 R37c0 R38c0 R39c0 R40c0 R41c0 = RES
U1c0 = LTC6655
U2c0 U3c0 = OPAMPx4

## Sheet LTC2335-16_1.SchDoc
size A; SheetNumber: 11; SheetTotal: 24
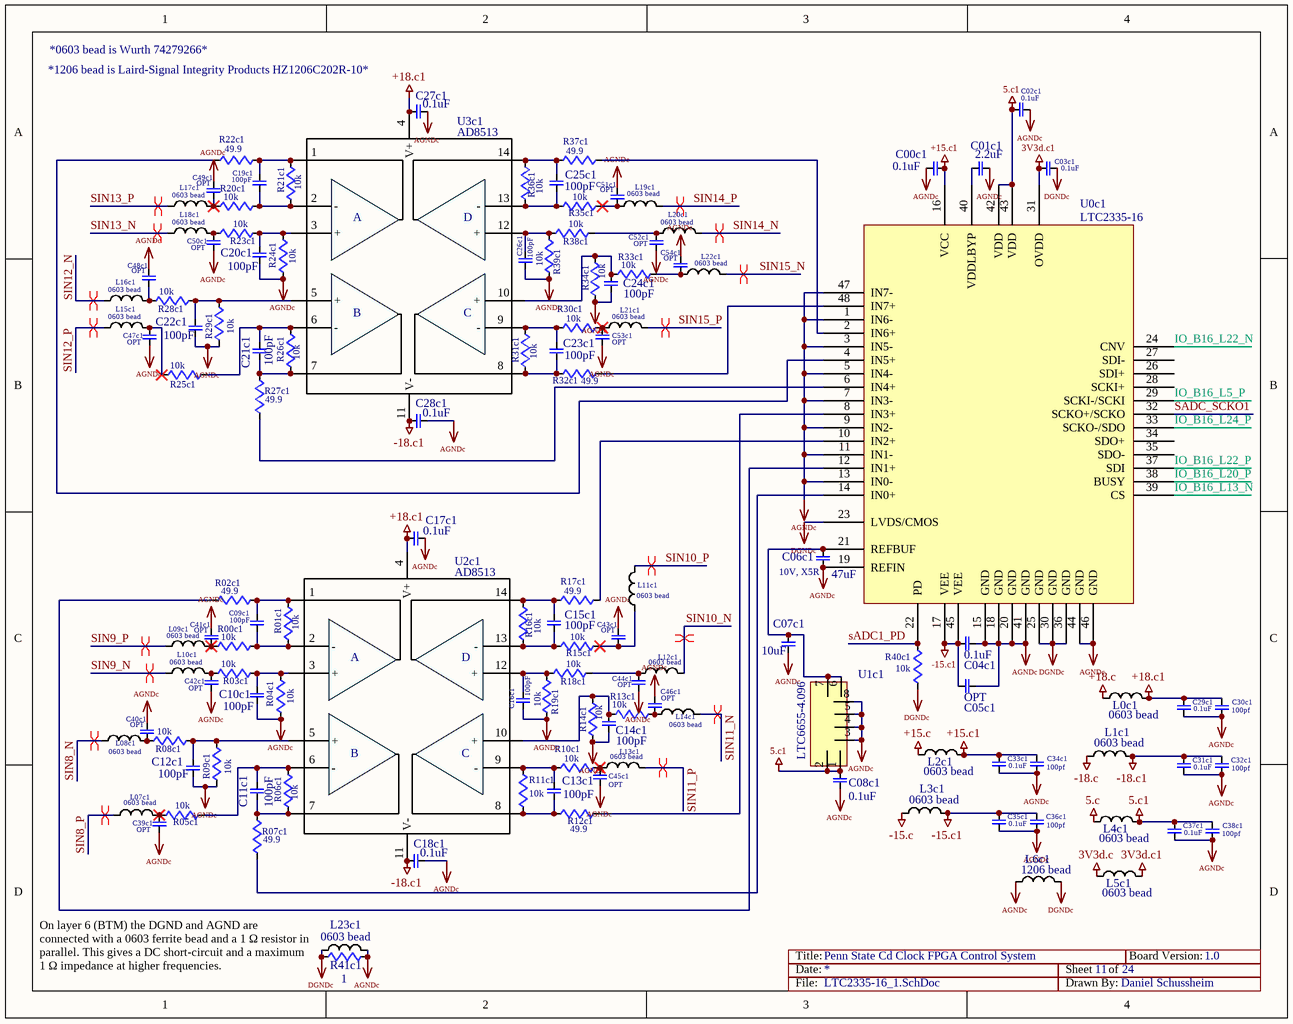
[diagram p13: LTC2335-16_1.SchDoc]

### Parts
C00c1  0.1uF  [0603]
C01c1  2.2uF  [0603]
C02c1  0.1uF  [0603]
C03c1  0.1uF  [0603]
C04c1  0.1uF  [0603]
C05c1  OPT  [0603]
C06c1  47uF  [1210]
C07c1  10uF  [0805]
C08c1  0.1uF  [0603]
C09c1  100pF  [0603]
C10c1  100pF  [0603]
C11c1  100pF  [0603]
C12c1  100pF  [0603]
C13c1  100pF  [0603]
C14c1  100pF  [0603]
C15c1  100pF  [0603]
C16c1  100pF  [0603]
C17c1  0.1uF  [0603]
C18c1  0.1uF  [0603]
C19c1  100pF  [0603]
C20c1  100pF  [0603]
C21c1  100pF  [0603]
C22c1  100pF  [0603]
C23c1  100pF  [0603]
C24c1  100pF  [0603]
C25c1  100pF  [0603]
C26c1  100pF  [0603]
C27c1  0.1uF  [0603]
C28c1  0.1uF  [0603]
C29c1  0.1uF  [0603]
C30c1  100pf  [0603]
C31c1  0.1uF  [0603]
C32c1  100pf  [0603]
C33c1  0.1uF  [0603]
C34c1  100pf  [0603]
C35c1  0.1uF  [0603]
C36c1  100pf  [0603]
C37c1  0.1uF  [0603]
C38c1  100pf  [0603]
C39c1  OPT  [0603]
C40c1  OPT  [0603]
C41c1  OPT  [0603]
C42c1  OPT  [0603]
C43c1  OPT  [0603]
C44c1  OPT  [0603]
C45c1  OPT  [0603]
C46c1  OPT  [0603]
C47c1  OPT  [0603]
C48c1  OPT  [0603]
C49c1  OPT  [0603]
C50c1  OPT  [0603]
C51c1  OPT  [0603]
C52c1  OPT  [0603]
C53c1  OPT  [0603]
C54c1  OPT  [0603]
L0c1  0603 bead  [0603]
L1c1  0603 bead  [0603]
L2c1  0603 bead  [0603]
L3c1  0603 bead  [0603]
L4c1  0603 bead  [0603]
L5c1  0603 bead  [0603]
L6c1  1206 bead  [1206]
L07c1  0603 bead  [0603]
L08c1  0603 bead  [0603]
L09c1  0603 bead  [0603]
L10c1  0603 bead  [0603]
L11c1  0603 bead  [0603]
L12c1  0603 bead  [0603]
L13c1  0603 bead  [0603]
L14c1  0603 bead  [0603]
L15c1  0603 bead  [0603]
L16c1  0603 bead  [0603]
L17c1  0603 bead  [0603]
L18c1  0603 bead  [0603]
L19c1  0603 bead  [0603]
L20c1  0603 bead  [0603]
L21c1  0603 bead  [0603]
L22c1  0603 bead  [0603]
L23c1  0603 bead  [0603]
R00c1  10k  [0603]
R01c1  10k  [0603]
R02c1  49.9  [0603]
R03c1  10k  [0603]
R04c1  10k  [0603]
R05c1  10k  [0603]
R06c1  10k  [0603]
R07c1  49.9  [0603]
R08c1  10k  [0603]
R09c1  10k  [0603]
R10c1  10k  [0603]
R11c1  10k  [0603]
R12c1  49.9  [0603]
R13c1  10k  [0603]
R14c1  10k  [0603]
R15c1  10k  [0603]
R16c1  10k  [0603]
R17c1  49.9  [0603]
R18c1  10k  [0603]
R19c1  10k  [0603]
R20c1  10k  [0603]
R21c1  10k  [0603]
R22c1  49.9  [0603]
R23c1  10k  [0603]
R24c1  10k  [0603]
R25c1  10k  [0603]
R26c1  10k  [0603]
R27c1  49.9  [0603]
R28c1  10k  [0603]
R29c1  10k  [0603]
R30c1  10k  [0603]
R31c1  10k  [0603]
R32c1  49.9  [0603]
R33c1  10k  [0603]
R34c1  10k  [0603]
R35c1  10k  [0603]
R36c1  10k  [0603]
R37c1  49.9  [0603]
R38c1  10k  [0603]
R39c1  10k  [0603]
R40c1  10k  [0603]
R41c1  1  [0603]
U0c1  LTC2335-16  [48LQFP]
U1c1  LTC6655-4.096  [8MSOP_1]
U2c1  AD8513  [14TSSOP]
U3c1  AD8513  [14TSSOP]

### Nets
3V3d.c: L5c1.1
3V3d.c1: C03c1.2 L5c1.2 U0c1.31(OVDD)
5.c: L4c1.1
5.c1: C02c1.2 C08c1.2 C37c1.1 C38c1.1 L4c1.2 U0c1.42(VDD) U0c1.43(VDD) U1c1.1(SHDN) U1c1.2(VIN)
+15.c: L2c1.1
+15.c1: C00c1.1 C33c1.1 C34c1.1 L2c1.2 U0c1.16(VCC)
+18.c: L0c1.1
+18.c1: C17c1.2 C27c1.2 C29c1.1 C30c1.1 L0c1.2 U2c1.4(V+) U3c1.4(V+)
-15.c: L3c1.1
-15.c1: C04c1.2 C05c1.2 C35c1.1 C36c1.1 L3c1.2 U0c1.17(VEE) U0c1.45(VEE)
-18.c: L1c1.1
-18.c1: C18c1.2 C28c1.2 C31c1.1 C32c1.1 L1c1.2 U2c1.11(V-) U3c1.11(V-)
AGNDc: C00c1.2 C01c1.1 C02c1.1 C03c1.1 C04c1.1 C05c1.1 C06c1.1 C07c1.1 C08c1.1 C10c1.2 C12c1.2 C14c1.2 C16c1.2 C17c1.1 C18c1.1 C20c1.2 C22c1.2 C24c1.1 C26c1.2 C27c1.1 C28c1.1 C29c1.2 C30c1.2 C31c1.2 C32c1.2 C33c1.2 C34c1.2 C35c1.2 C36c1.2 C37c1.2 C38c1.2 C39c1.2 C40c1.1 C41c1.1 C42c1.2 C43c1.1 C44c1.1 C45c1.1 C46c1.1 C47c1.2 C48c1.1 C49c1.1 C50c1.2 C51c1.1 C52c1.2 C53c1.2 C54c1.1 L6c1.1 L6c1.2 L23c1.1 L23c1.2 R04c1.1 R09c1.1 R14c1.1 R19c1.1 R24c1.1 R29c1.1 R34c1.1 R39c1.1 R40c1.1 R41c1.1 R41c1.2 U0c1.1(IN6-) U0c1.3(IN5-) U0c1.5(IN4-) U0c1.7(IN3-) U0c1.9(IN2-) U0c1.11(IN1-) U0c1.13(IN0-) U0c1.15(GND) U0c1.18(GND) U0c1.19(REFIN) U0c1.20(GND) U0c1.23(LVDS/CMOS) U0c1.25(GND) U0c1.30(GND) U0c1.36(GND) U0c1.41(GND) U0c1.44(GND) U0c1.46(GND) U0c1.47(IN7-) U1c1.3(GND) U1c1.4(GND) U1c1.5(GND) U1c1.8(GND)  [also labelled DGNDc]  [project net AGNDa]
IO_B16_L5_P: U0c1.29(SCKI-/SCKI)
IO_B16_L13_N: U0c1.39(CS)
IO_B16_L20_P: U0c1.38(BUSY)
IO_B16_L22_N: U0c1.24(CNV)
IO_B16_L22_P: U0c1.37(SDI)
IO_B16_L24_P: U0c1.33(SCKO-/SDO)
sADC1_PD: R40c1.2 U0c1.22(PD)
SADC_SCKO1: U0c1.32(SCKO+/SCKO)
SIN8_N: L08c1.1
SIN8_P: L07c1.1
SIN9_N: L10c1.1
SIN9_P: L09c1.1
SIN10_N: L12c1.2
SIN10_P: L11c1.2
SIN11_N: L14c1.2
SIN11_P: L13c1.2
SIN12_N: L16c1.1
SIN12_P: L15c1.1
SIN13_N: L18c1.1
SIN13_P: L17c1.1
SIN14_N: L20c1.2
SIN14_P: L19c1.2
SIN15_N: L22c1.2
SIN15_P: L21c1.2
NetC01c1_2: C01c1.2 U0c1.40(VDDLBYP)
NetC06c1_2: C06c1.2 C07c1.2 U0c1.21(REFBUF) U1c1.6(VOUT_S) U1c1.7(VOUT_F)
NetC09c1_1: C09c1.1 R01c1.2 R02c1.2 U2c1.1(OUTA)
NetC09c1_2: C09c1.2 R00c1.2 R01c1.1 U2c1.2(-)
NetC10c1_1: C10c1.1 R03c1.2 R04c1.2 U2c1.3(+)
NetC11c1_1: C11c1.1 R06c1.1 R07c1.2 U2c1.7(OUTB)
NetC11c1_2: C11c1.2 R05c1.1 R06c1.2 U2c1.6(-)
NetC12c1_1: C12c1.1 R08c1.2 R09c1.2 U2c1.5(+)
NetC13c1_1: C13c1.1 R11c1.1 R12c1.1 U2c1.8(OUTB)
NetC13c1_2: C13c1.2 R10c1.1 R11c1.2 U2c1.9(-)
NetC14c1_1: C14c1.1 R13c1.1 R14c1.2 U2c1.10(+)
NetC15c1_1: C15c1.1 R16c1.2 R17c1.1 U2c1.14(OUTA)
NetC15c1_2: C15c1.2 R15c1.1 R16c1.1 U2c1.13(-)
NetC16c1_1: C16c1.1 R18c1.1 R19c1.2 U2c1.12(+)
NetC19c1_1: C19c1.1 R21c1.2 R22c1.2 U3c1.1(OUTA)
NetC19c1_2: C19c1.2 R20c1.2 R21c1.1 U3c1.2(-)
NetC20c1_1: C20c1.1 R23c1.2 R24c1.2 U3c1.3(+)
NetC21c1_1: C21c1.1 R26c1.1 R27c1.2 U3c1.7(OUTB)
NetC21c1_2: C21c1.2 R25c1.1 R26c1.2 U3c1.6(-)
NetC22c1_1: C22c1.1 R28c1.2 R29c1.2 U3c1.5(+)
NetC23c1_1: C23c1.1 R31c1.1 R32c1.1 U3c1.8(OUTB)
NetC23c1_2: C23c1.2 R30c1.1 R31c1.2 U3c1.9(-)
NetC24c1_2: C24c1.2 R33c1.1 R34c1.2 U3c1.10(+)
NetC25c1_1: C25c1.1 R36c1.2 R37c1.1 U3c1.14(OUTA)
NetC25c1_2: C25c1.2 R35c1.1 R36c1.1 U3c1.13(-)
NetC26c1_1: C26c1.1 R38c1.1 R39c1.2 U3c1.12(+)
NetC39c1_1: C39c1.1 L07c1.2 R05c1.2
NetC40c1_2: C40c1.2 L08c1.2 R08c1.1
NetC41c1_2: C41c1.2 L09c1.2 R00c1.1
NetC42c1_1: C42c1.1 L10c1.2 R03c1.1
NetC43c1_2: C43c1.2 L11c1.1 R15c1.2
NetC44c1_2: C44c1.2 L12c1.1 R18c1.2
NetC45c1_2: C45c1.2 L13c1.1 R10c1.2
NetC46c1_2: C46c1.2 L14c1.1 R13c1.2
NetC47c1_1: C47c1.1 L15c1.2 R25c1.2
NetC48c1_2: C48c1.2 L16c1.2 R28c1.1
NetC49c1_2: C49c1.2 L17c1.2 R20c1.1
NetC50c1_1: C50c1.1 L18c1.2 R23c1.1
NetC51c1_2: C51c1.2 L19c1.1 R35c1.2
NetC52c1_1: C52c1.1 L20c1.1 R38c1.2
NetC53c1_1: C53c1.1 L21c1.1 R30c1.2
NetC54c1_2: C54c1.2 L22c1.1 R33c1.2
NetR02c1_1: R02c1.1 U0c1.12(IN1+)
NetR07c1_1: R07c1.1 U0c1.14(IN0+)
NetR12c1_2: R12c1.2 U0c1.8(IN3+)
NetR17c1_2: R17c1.2 U0c1.10(IN2+)
NetR22c1_1: R22c1.1 U0c1.4(IN5+)
NetR27c1_1: R27c1.1 U0c1.6(IN4+)
NetR32c1_2: R32c1.2 U0c1.48(IN7+)
NetR37c1_2: R37c1.2 U0c1.2(IN6+)

Not connected (* = marked no-connect by the designer): U0c1 26(SDI+) 27(SDI-) 28(SCKI+) 34(SDO+) 35(SDO-)

### Layout directives
differential pair: SIN8_N, SIN8_P, SIN9_N, SIN9_P, SIN10_N, SIN10_P, SIN11_N, SIN11_P, SIN12_N, SIN12_P, SIN13_N, SIN13_P, SIN14_N, SIN14_P, SIN15_N, SIN15_P

### Notes on the sheet
- (near C27c1) *1206 bead is Laird-Signal Integrity Products HZ1206C202R-10*
- *0603 bead is Wurth 74279266*
- (near C06c1) 10V, X5R
- Title:
- Date:
- Sheet
- of
- Board Version:
- On layer 6 (BTM) the DGND and AGND are connected with a 0603 ferrite bead and a 1 Ω resistor in parallel. This gives a DC short-circuit and a maximum 1 Ω impedance at higher frequencies.
- File:
- Drawn By:
- (in symbol OPAMPx4) A; D; B; C

### Library data of the parts
C00c1 C01c1 C02c1 C03c1 C04c1 C05c1 C06c1 C07c1 C08c1 C09c1 C10c1 C11c1 C12c1 C13c1 C14c1 C15c1 C16c1 C17c1 C18c1 C19c1 C20c1 C21c1 C22c1 C23c1 C24c1 C25c1 C26c1 C27c1 C28c1 C29c1 C30c1 C31c1 C32c1 C33c1 C34c1 C35c1 C36c1 C37c1 C38c1 C39c1 C40c1 C41c1 C42c1 C43c1 C44c1 C45c1 C46c1 C47c1 C48c1 C49c1 C50c1 C51c1 C52c1 C53c1 C54c1 = CAP
L0c1 L1c1 L2c1 L3c1 L4c1 L5c1 L6c1 L07c1 L08c1 L09c1 L10c1 L11c1 L12c1 L13c1 L14c1 L15c1 L16c1 L17c1 L18c1 L19c1 L20c1 L21c1 L22c1 L23c1 = INDUCTOR
R00c1 R01c1 R02c1 R03c1 R04c1 R05c1 R06c1 R07c1 R08c1 R09c1 R10c1 R11c1 R12c1 R13c1 R14c1 R15c1 R16c1 R17c1 R18c1 R19c1 R20c1 R21c1 R22c1 R23c1 R24c1 R25c1 R26c1 R27c1 R28c1 R29c1 R30c1 R31c1 R32c1 R33c1 R34c1 R35c1 R36c1 R37c1 R38c1 R39c1 R40c1 R41c1 = RES
U1c1 = LTC6655
U2c1 U3c1 = OPAMPx4

## Sheet Connectors.SchDoc
size A; SheetNumber: 23; SheetTotal: 24
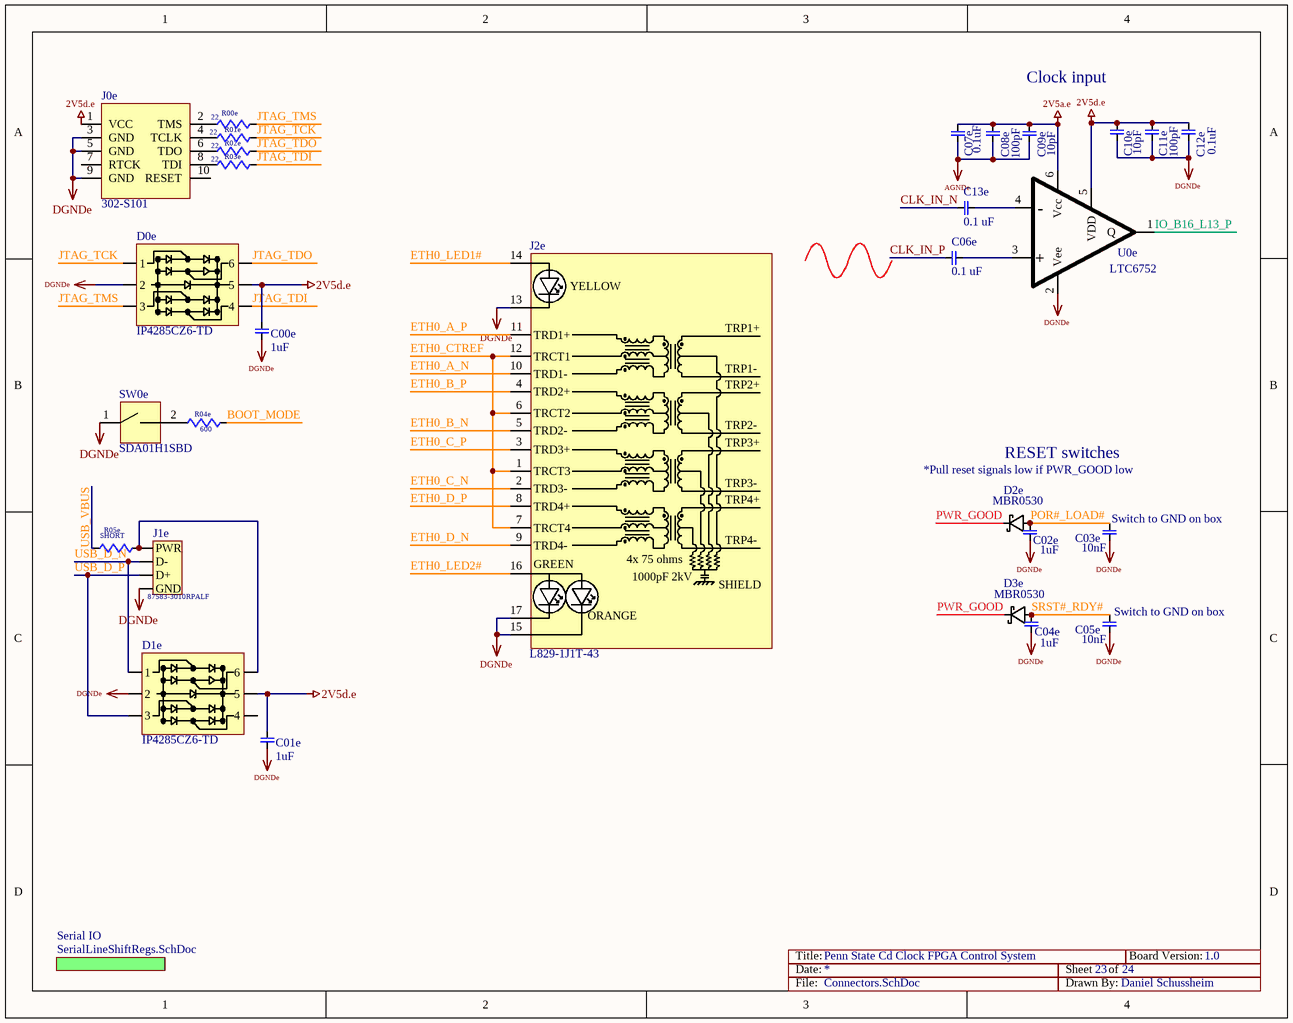
[diagram p14: Connectors.SchDoc]

### Parts
C00e  1uF  [0603]
C01e  1uF  [0603]
C02e  1uF  [0603]
C03e  10nF  [0603]
C04e  1uF  [0603]
C05e  10nF  [0603]
C06e  0.1 uF  [0805]
C07e  0.1uF  [0603]
C08e  100pF  [0603]
C09e  10pF  [0603]
C10e  10pF  [0603]
C11e  100pF  [0603]
C12e  0.1uF  [0603]
C13e  0.1 uF  [0805]
D0e  IP4285CZ6-TD  [6-TSOP]
D1e  IP4285CZ6-TD  [6-TSOP]
D2e  MBR0530  [SOD123]
D3e  MBR0530  [SOD123]
J0e  302-S101  [3020-10-0300-00]
J1e  87583-3010RPALF  [87583-3010RPALF]
J2e  L829-1J1T-43  [L829-1J1T-43]
R00e  22  [0603]
R01e  22  [0603]
R02e  22  [0603]
R03e  22  [0603]
R04e  600  [0603]
R05e  SHORT  [0603]
SW0e  SDA01H1SBD  [SDA01H1SBD]
U0e  LTC6752  [sc70]

### Sub-sheets
Serial IO = SerialLineShiftRegs.SchDoc: no entries

### Nets
2V5a.e: C07e.1 C08e.1 C09e.1 U0e.6(Vcc)
2V5d.e: C00e.1 C01e.1 C10e.1 C11e.1 C12e.1 D0e.5 D1e.5 J0e.1(VCC) U0e.5(VDD)
AGNDe: C07e.2 C08e.2 C09e.2
DGNDe: C00e.2 C01e.2 C02e.2 C03e.2 C04e.2 C05e.2 C10e.2 C11e.2 C12e.2 D0e.2 D1e.2 J0e.3(GND) J0e.5(GND) J0e.9(GND) J1e.GND J2e.13 J2e.15 J2e.17 SW0e.1 U0e.2(Vee)  [project net AGNDa]
BOOT_MODE: R04e.2
CLK_IN_N: C13e.1
CLK_IN_P: C06e.1
ETH0_A_N: J2e.10(TRD1-)
ETH0_A_P: J2e.11(TRD1+)
ETH0_B_N: J2e.5(TRD2-)
ETH0_B_P: J2e.4(TRD2+)
ETH0_C_N: J2e.2(TRD3-)
ETH0_C_P: J2e.3(TRD3+)
ETH0_CTREF: J2e.1(TRCT3) J2e.6(TRCT2) J2e.7(TRCT4) J2e.12(TRCT1)
ETH0_D_N: J2e.9(TRD4-)
ETH0_D_P: J2e.8(TRD4+)
ETH0_LED1#: J2e.14
ETH0_LED2#: J2e.16
IO_B16_L13_P: U0e.1(Q)
JTAG_TCK: D0e.1 R01e.2
JTAG_TDI: D0e.4 R03e.2
JTAG_TDO: D0e.6 R02e.2
JTAG_TMS: D0e.3 R00e.1
POR#_LOAD#: C02e.1 C03e.1 D2e.2
PWR_GOOD: D2e.1 D3e.1
SRST#_RDY#: C04e.1 C05e.1 D3e.2
USB_D_N: D1e.1 J1e.D-
USB_D_P: D1e.3 J1e.D+
USB_VBUS: R05e.1
NetC06e_2: C06e.2 U0e.3(+)
NetC13e_2: C13e.2 U0e.4(-)
NetD1e_6: D1e.6 J1e.PWR R05e.2
NetJ0e_2: J0e.2(TMS) R00e.2
NetJ0e_4: J0e.4(TCLK) R01e.1
NetJ0e_6: J0e.6(TDO) R02e.1
NetJ0e_8: J0e.8(TDI) R03e.1
NetR04e_1: R04e.1 SW0e.2

Not connected (* = marked no-connect by the designer): D1e 4; J0e 7(RTCK) 10(RESET)

### Notes on the sheet
- Clock input
- *Pull reset signals low if PWR_GOOD low
- RESET switches
- (near C03e) Switch to GND on box
- (near C05e) Switch to GND on box
- Title:
- Date:
- Sheet
- of
- Board Version:
- File:
- Drawn By:
- (in symbol L829-1J1T-43) YELLOW; TRP1+; TRP1-; TRP2+; TRP2-; TRP3+; TRP3-; TRP4+; TRP4-; 4x 75 ohms; GREEN; 1000pF 2kV; SHIELD; ORANGE

### Library data of the parts
C00e C01e C02e C03e C04e C05e C06e C07e C08e C09e C10e C11e C12e C13e = CAP
D2e D3e = Schottky_Diode
J0e = JTAG_10: JTAG Connector
R00e R01e R02e R03e R04e R05e = RES
SW0e = SW1

## Sheet SerialLineShiftRegs.SchDoc
size A; SheetNumber: 24; SheetTotal: 24
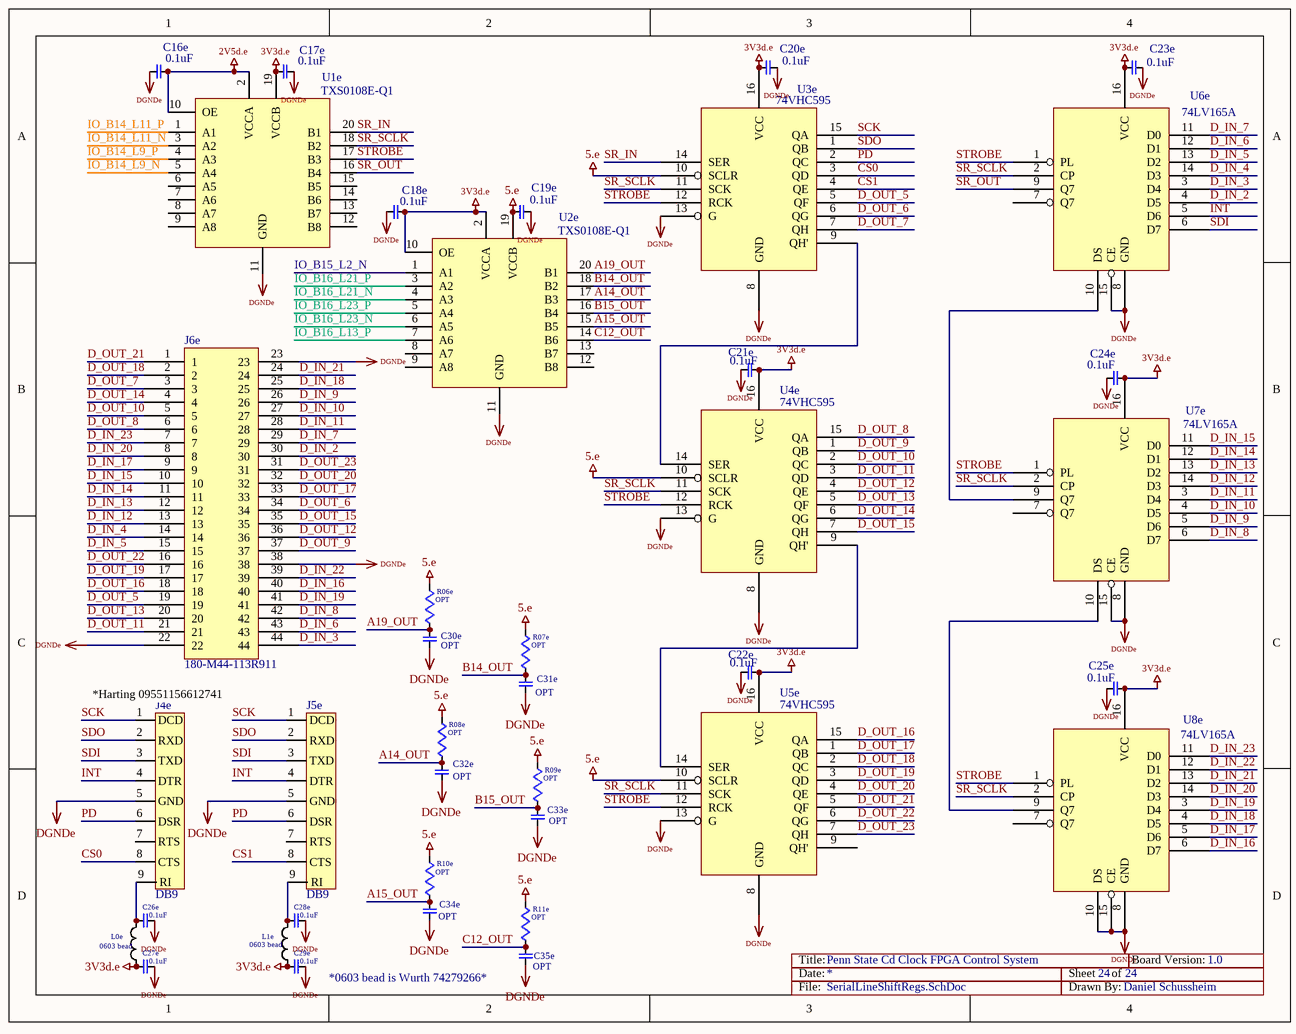
[diagram p15: SerialLineShiftRegs.SchDoc]

### Parts
C16e  0.1uF  [0603]
C17e  0.1uF  [0603]
C18e  0.1uF  [0603]
C19e  0.1uF  [0603]
C20e  0.1uF  [0603]
C21e  0.1uF  [0603]
C22e  0.1uF  [0603]
C23e  0.1uF  [0603]
C24e  0.1uF  [0603]
C25e  0.1uF  [0603]
C26e  0.1uF  [0603]
C27e  0.1uF  [0603]
C28e  0.1uF  [0603]
C29e  0.1uF  [0603]
C30e  OPT  [0603]
C31e  OPT  [0603]
C32e  OPT  [0603]
C33e  OPT  [0603]
C34e  OPT  [0603]
C35e  OPT  [0603]
J4e  DB9  [9-Pin_D-Connector_SMT]
J5e  DB9  [9-Pin_D-Connector_SMT]
J6e  180-M44-113R911  [180-M44-213R911]
L0e  0603 bead  [0603]
L1e  0603 bead  [0603]
R06e  OPT  [0603]
R07e  OPT  [0603]
R08e  OPT  [0603]
R09e  OPT  [0603]
R10e  OPT  [0603]
R11e  OPT  [0603]
U1e  TXS0108E-Q1  [R-PDSO-G20]
U2e  TXS0108E-Q1  [R-PDSO-G20]
U3e  74VHC595  [16TSSOP]
U4e  74VHC595  [16TSSOP]
U5e  74VHC595  [16TSSOP]
U6e  74LV165A  [16TSSOP]
U7e  74LV165A  [16TSSOP]
U8e  74LV165A  [16TSSOP]

### Nets
2V5d.e: C16e.1 U1e.2(VCCA) U1e.10(OE)
3V3d.e: C17e.2 C18e.1 C20e.2 C21e.1 C22e.1 C23e.2 C24e.1 C25e.1 C27e.2 C29e.2 L0e.1 L1e.1 U1e.19(VCCB) U2e.2(VCCA) U2e.10(OE) U3e.16(VCC) U4e.16(VCC) U5e.16(VCC) U6e.16(VCC) U7e.16(VCC) U8e.16(VCC)
5.e: C19e.2 R06e.1 R07e.1 R08e.1 R09e.1 R10e.1 R11e.1 U2e.19(VCCB) U3e.10(SCLR) U4e.10(SCLR) U5e.10(SCLR)
DGNDe: C16e.2 C17e.1 C18e.2 C19e.1 C20e.1 C21e.2 C22e.2 C23e.1 C24e.2 C25e.2 C26e.1 C27e.1 C28e.1 C29e.1 C30e.2 C31e.2 C32e.2 C33e.2 C34e.2 C35e.2 J4e.5(GND) J5e.5(GND) J6e.22 J6e.23 J6e.38 U1e.11(GND) U2e.11(GND) U3e.8(GND) U3e.13(G) U4e.8(GND) U4e.13(G) U5e.8(GND) U5e.13(G) U6e.8(GND) U6e.15(CE) U7e.8(GND) U7e.15(CE) U8e.8(GND) U8e.10(DS) U8e.15(CE)  [project net AGNDa]
A14_OUT: C32e.1 R08e.2 U2e.17(B3)
A15_OUT: C34e.1 R10e.2 U2e.15(B5)
A19_OUT: C30e.1 R06e.2 U2e.20(B1)
B14_OUT: C31e.1 R07e.2 U2e.18(B2)
B15_OUT: C33e.1 R09e.2 U2e.16(B4)
C12_OUT: C35e.1 R11e.2 U2e.14(B6)
CS0: J4e.8(CTS) U3e.3(QD)
CS1: J5e.8(CTS) U3e.4(QE)
D_IN_2: J6e.30 U6e.4(D5)
D_IN_3: J6e.44 U6e.3(D4)
D_IN_4: J6e.14 U6e.14(D3)
D_IN_5: J6e.15 U6e.13(D2)
D_IN_6: J6e.43 U6e.12(D1)
D_IN_7: J6e.29 U6e.11(D0)
D_IN_8: J6e.42 U7e.6(D7)
D_IN_9: J6e.26 U7e.5(D6)
D_IN_10: J6e.27 U7e.4(D5)
D_IN_11: J6e.28 U7e.3(D4)
D_IN_12: J6e.13 U7e.14(D3)
D_IN_13: J6e.12 U7e.13(D2)
D_IN_14: J6e.11 U7e.12(D1)
D_IN_15: J6e.10 U7e.11(D0)
D_IN_16: J6e.40 U8e.6(D7)
D_IN_17: J6e.9 U8e.5(D6)
D_IN_18: J6e.25 U8e.4(D5)
D_IN_19: J6e.41 U8e.3(D4)
D_IN_20: J6e.8 U8e.14(D3)
D_IN_21: J6e.24 U8e.13(D2)
D_IN_22: J6e.39 U8e.12(D1)
D_IN_23: J6e.7 U8e.11(D0)
D_OUT_5: J6e.19 U3e.5(QF)
D_OUT_6: J6e.34 U3e.6(QG)
D_OUT_7: J6e.3 U3e.7(QH)
D_OUT_8: J6e.6 U4e.15(QA)
D_OUT_9: J6e.37 U4e.1(QB)
D_OUT_10: J6e.5 U4e.2(QC)
D_OUT_11: J6e.21 U4e.3(QD)
D_OUT_12: J6e.36 U4e.4(QE)
D_OUT_13: J6e.20 U4e.5(QF)
D_OUT_14: J6e.4 U4e.6(QG)
D_OUT_15: J6e.35 U4e.7(QH)
D_OUT_16: J6e.18 U5e.15(QA)
D_OUT_17: J6e.33 U5e.1(QB)
D_OUT_18: J6e.2 U5e.2(QC)
D_OUT_19: J6e.17 U5e.3(QD)
D_OUT_20: J6e.32 U5e.4(QE)
D_OUT_21: J6e.1 U5e.5(QF)
D_OUT_22: J6e.16 U5e.6(QG)
D_OUT_23: J6e.31 U5e.7(QH)
INT: J4e.4(DTR) J5e.4(DTR) U6e.5(D6)
IO_B14_L9_N: U1e.5(A4)
IO_B14_L9_P: U1e.4(A3)
IO_B14_L11_N: U1e.3(A2)
IO_B14_L11_P: U1e.1(A1)
IO_B15_L2_N: U2e.1(A1)
IO_B16_L13_P: U2e.7(A6)
IO_B16_L21_N: U2e.4(A3)
IO_B16_L21_P: U2e.3(A2)
IO_B16_L23_N: U2e.6(A5)
IO_B16_L23_P: U2e.5(A4)
PD: J4e.6(DSR) J5e.6(DSR) U3e.2(QC)
SCK: J4e.1(DCD) J5e.1(DCD) U3e.15(QA)
SDI: J4e.3(TXD) J5e.3(TXD) U6e.6(D7)
SDO: J4e.2(RXD) J5e.2(RXD) U3e.1(QB)
SR_IN: U1e.20(B1) U3e.14(SER)
SR_OUT: U1e.16(B4) U6e.9(Q7)
SR_SCLK: U1e.18(B2) U3e.11(SCK) U4e.11(SCK) U5e.11(SCK) U6e.2(CP) U7e.2(CP) U8e.2(CP)
STROBE: U1e.17(B3) U3e.12(RCK) U4e.12(RCK) U5e.12(RCK) U6e.1(PL) U7e.1(PL) U8e.1(PL)
NetC26e_2: C26e.2 J4e.9(RI) L0e.2
NetC28e_2: C28e.2 J5e.9(RI) L1e.2
NetU3e_9: U3e.9(QH') U4e.14(SER)
NetU4e_9: U4e.9(QH') U5e.14(SER)
NetU6e_10: U6e.10(DS) U7e.9(Q7)
NetU7e_10: U7e.10(DS) U8e.9(Q7)

Not connected (* = marked no-connect by the designer): J4e 7(RTS); J5e 7(RTS); U1e 6(A5) 7(A6) 8(A7) 9(A8) 12(B8) 13(B7) 14(B6) 15(B5); U2e 8(A7) 9(A8) 12(B8) 13(B7); U5e 9(QH'); U6e 7(Q7); U7e 7(Q7); U8e 7(Q7)

### Notes on the sheet
- (near J4e) *Harting 09551156612741
- *0603 bead is Wurth 74279266*
- Title:
- Date:
- Sheet
- of
- Board Version:
- File:
- Drawn By:

### Library data of the parts
C16e C17e C18e C19e C20e C21e C22e C23e C24e C25e C26e C27e C28e C29e C30e C31e C32e C33e C34e C35e = CAP
J6e = DSUB44
L0e L1e = INDUCTOR
R06e R07e R08e R09e R10e R11e = RES
U1e U2e = 8BitLevelShifter

## Sheet ModuleConnectorC.SchDoc
size A portrait; SheetNumber: 3; SheetTotal: 24
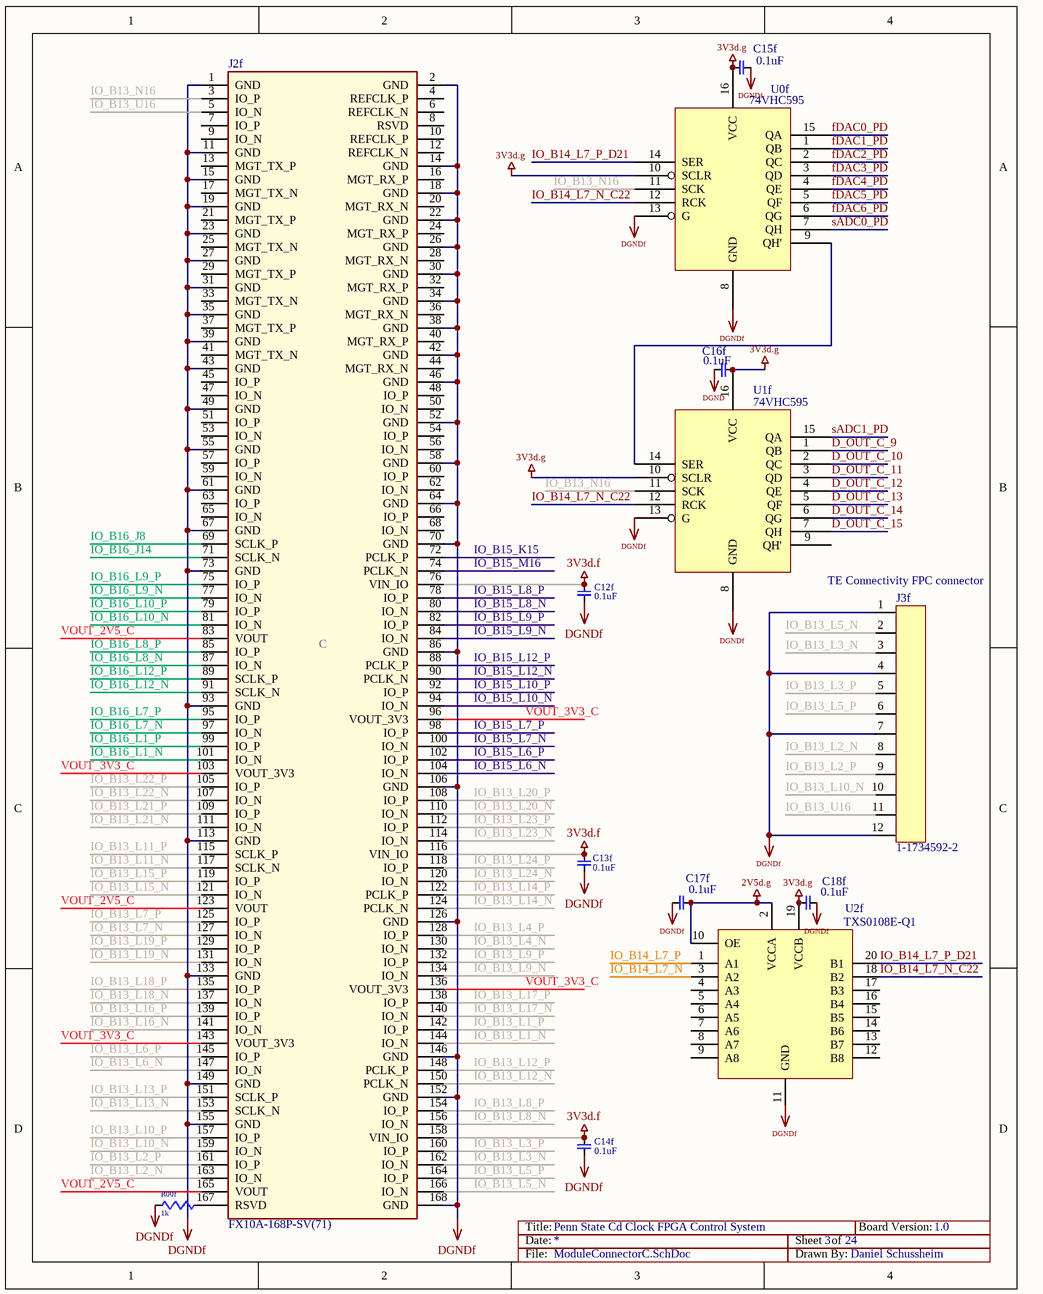
[diagram p16: ModuleConnectorC.SchDoc]

### Parts
C12f  0.1uF  [0603]
C13f  0.1uF  [0603]
C14f  0.1uF  [0603]
C15f  0.1uF  [0603]
C16f  0.1uF  [0603]
C17f  0.1uF  [0603]
C18f  0.1uF  [0603]
J2f  FX10A-168P-SV(71)  [Mercury_Baseboard_Connector]
J3f  1-1734592-2  [FPC12]
R00f  1k  [0603]
U0f  74VHC595  [16TSSOP]
U1f  74VHC595  [16TSSOP]
U2f  TXS0108E-Q1  [R-PDSO-G20]

### Nets
2V5d.g: C17f.1 U2f.2(VCCA) U2f.10(OE)
3V3d.f: C12f.1 C13f.1 C14f.1 J2f.76(VIN_IO) J2f.116(VIN_IO) J2f.158(VIN_IO)
3V3d.g: C15f.2 C16f.1 C18f.2 U0f.10(SCLR) U0f.16(VCC) U1f.10(SCLR) U1f.16(VCC) U2f.19(VCCB)
DGND: C12f.2 C13f.2 C14f.2 C15f.1 C16f.2 C17f.2 C18f.1 J2f.1(GND) J2f.2(GND) J2f.11(GND) J2f.14(GND) J2f.15(GND) J2f.18(GND) J2f.19(GND) J2f.22(GND) J2f.23(GND) J2f.26(GND) J2f.27(GND) J2f.30(GND) J2f.31(GND) J2f.34(GND) J2f.35(GND) J2f.38(GND) J2f.39(GND) J2f.42(GND) J2f.43(GND) J2f.46(GND) J2f.49(GND) J2f.52(GND) J2f.55(GND) J2f.58(GND) J2f.61(GND) J2f.64(GND) J2f.67(GND) J2f.70(GND) J2f.73(GND) J2f.86(GND) J2f.93(GND) J2f.106(GND) J2f.113(GND) J2f.126(GND) J2f.133(GND) J2f.146(GND) J2f.149(GND) J2f.152(GND) J2f.155(GND) J2f.168(GND) J3f.1 J3f.4 J3f.7 J3f.12 R00f.2 U0f.8(GND) U0f.13(G) U1f.8(GND) U1f.13(G) U2f.11(GND)  [also labelled DGNDf]  [project net AGNDa]
D_OUT_C_9: U1f.1(QB)
D_OUT_C_10: U1f.2(QC)
D_OUT_C_11: U1f.3(QD)
D_OUT_C_12: U1f.4(QE)
D_OUT_C_13: U1f.5(QF)
D_OUT_C_14: U1f.6(QG)
D_OUT_C_15: U1f.7(QH)
fDAC0_PD: U0f.15(QA)
fDAC1_PD: U0f.1(QB)
fDAC2_PD: U0f.2(QC)
fDAC3_PD: U0f.3(QD)
fDAC4_PD: U0f.4(QE)
fDAC5_PD: U0f.5(QF)
fDAC6_PD: U0f.6(QG)
IO_B13_L1_N: J2f.144(IO_N)
IO_B13_L1_P: J2f.142(IO_P)
IO_B13_L2_N: J2f.163(IO_N) J3f.8
IO_B13_L2_P: J2f.161(IO_P) J3f.9
IO_B13_L3_N: J2f.162(IO_N) J3f.3
IO_B13_L3_P: J2f.160(IO_P) J3f.5
IO_B13_L4_N: J2f.130(IO_N)
IO_B13_L4_P: J2f.128(IO_P)
IO_B13_L5_N: J2f.166(IO_N) J3f.2
IO_B13_L5_P: J2f.164(IO_P) J3f.6
IO_B13_L6_N: J2f.147(IO_N)
IO_B13_L6_P: J2f.145(IO_P)
IO_B13_L7_N: J2f.127(IO_N)
IO_B13_L7_P: J2f.125(IO_P)
IO_B13_L8_N: J2f.156(IO_N)
IO_B13_L8_P: J2f.154(IO_P)
IO_B13_L9_N: J2f.134(IO_N)
IO_B13_L9_P: J2f.132(IO_P)
IO_B13_L10_N: J2f.159(IO_N) J3f.10
IO_B13_L10_P: J2f.157(IO_P)
IO_B13_L11_N: J2f.117(SCLK_N)
IO_B13_L11_P: J2f.115(SCLK_P)
IO_B13_L12_N: J2f.150(PCLK_N)
IO_B13_L12_P: J2f.148(PCLK_P)
IO_B13_L13_N: J2f.153(SCLK_N)
IO_B13_L13_P: J2f.151(SCLK_P)
IO_B13_L14_N: J2f.124(PCLK_N)
IO_B13_L14_P: J2f.122(PCLK_P)
IO_B13_L15_N: J2f.121(IO_N)
IO_B13_L15_P: J2f.119(IO_P)
IO_B13_L16_N: J2f.141(IO_N)
IO_B13_L16_P: J2f.139(IO_P)
IO_B13_L17_N: J2f.140(IO_N)
IO_B13_L17_P: J2f.138(IO_P)
IO_B13_L18_N: J2f.137(IO_N)
IO_B13_L18_P: J2f.135(IO_P)
IO_B13_L19_N: J2f.131(IO_N)
IO_B13_L19_P: J2f.129(IO_P)
IO_B13_L20_N: J2f.110(IO_N)
IO_B13_L20_P: J2f.108(IO_P)
IO_B13_L21_N: J2f.111(IO_N)
IO_B13_L21_P: J2f.109(IO_P)
IO_B13_L22_N: J2f.107(IO_N)
IO_B13_L22_P: J2f.105(IO_P)
IO_B13_L23_N: J2f.114(IO_N)
IO_B13_L23_P: J2f.112(IO_P)
IO_B13_L24_N: J2f.120(IO_N)
IO_B13_L24_P: J2f.118(IO_P)
IO_B13_N16: J2f.3(IO_P) U0f.11(SCK) U1f.11(SCK)
IO_B13_U16: J2f.5(IO_N) J3f.11
IO_B14_L7_N: U2f.3(A2)
IO_B14_L7_N_C22: U0f.12(RCK) U1f.12(RCK) U2f.18(B2)
IO_B14_L7_P: U2f.1(A1)
IO_B14_L7_P_D21: U0f.14(SER) U2f.20(B1)
IO_B15_K15: J2f.72(PCLK_P)
IO_B15_L6_N: J2f.104(IO_N)
IO_B15_L6_P: J2f.102(IO_P)
IO_B15_L7_N: J2f.100(IO_N)
IO_B15_L7_P: J2f.98(IO_P)
IO_B15_L8_N: J2f.80(IO_N)
IO_B15_L8_P: J2f.78(IO_P)
IO_B15_L9_N: J2f.84(IO_N)
IO_B15_L9_P: J2f.82(IO_P)
IO_B15_L10_N: J2f.94(IO_N)
IO_B15_L10_P: J2f.92(IO_P)
IO_B15_L12_N: J2f.90(PCLK_N)
IO_B15_L12_P: J2f.88(PCLK_P)
IO_B15_M16: J2f.74(PCLK_N)
IO_B16_J8: J2f.69(SCLK_P)
IO_B16_J14: J2f.71(SCLK_N)
IO_B16_L1_N: J2f.101(IO_N)
IO_B16_L1_P: J2f.99(IO_P)
IO_B16_L7_N: J2f.97(IO_N)
IO_B16_L7_P: J2f.95(IO_P)
IO_B16_L8_N: J2f.87(IO_N)
IO_B16_L8_P: J2f.85(IO_P)
IO_B16_L9_N: J2f.77(IO_N)
IO_B16_L9_P: J2f.75(IO_P)
IO_B16_L10_N: J2f.81(IO_N)
IO_B16_L10_P: J2f.79(IO_P)
IO_B16_L12_N: J2f.91(SCLK_N)
IO_B16_L12_P: J2f.89(SCLK_P)
sADC0_PD: U0f.7(QH)
sADC1_PD: U1f.15(QA)
VOUT_2V5_C: J2f.83(VOUT) J2f.123(VOUT) J2f.165(VOUT)
VOUT_3V3_C: J2f.96(VOUT_3V3) J2f.103(VOUT_3V3) J2f.136(VOUT_3V3) J2f.143(VOUT_3V3)
NetJ2f_167: J2f.167(RSVD) R00f.1
NetU0f_9: U0f.9(QH') U1f.14(SER)

Not connected (* = marked no-connect by the designer): J2f 4(REFCLK_P) 6(REFCLK_N) 7(IO_P) 8(RSVD) 9(IO_N) 10(REFCLK_P) 12(REFCLK_N) 13(MGT_TX_P) 16(MGT_RX_P) 17(MGT_TX_N) 20(MGT_RX_N) 21(MGT_TX_P) 24(MGT_RX_P) 25(MGT_TX_N) 28(MGT_RX_N) 29(MGT_TX_P) 32(MGT_RX_P) 33(MGT_TX_N) 36(MGT_RX_N) 37(MGT_TX_P) 40(MGT_RX_P) 41(MGT_TX_N) 44(MGT_RX_N) 45(IO_P) 47(IO_N) 48(IO_P) 50(IO_N) 51(IO_P) 53(IO_N) 54(IO_P) 56(IO_N) 57(IO_P) 59(IO_N) 60(IO_P) 62(IO_N) 63(IO_P) 65(IO_N) 66(IO_P) 68(IO_N); U1f 9(QH'); U2f 4(A3) 5(A4) 6(A5) 7(A6) 8(A7) 9(A8) 12(B8) 13(B7) 14(B6) 15(B5) 16(B4) 17(B3)

### Notes on the sheet
- TE Connectivity FPC connector
- Title:
- Date:
- Sheet
- of
- Board Version:
- File:
- Drawn By:
- (in symbol Mercury_Baseboard_Connector-C) C

### Library data of the parts
C12f C13f C14f C15f C16f C17f C18f = CAP
J2f = Mercury_Baseboard_Connector-C: Mercury Baseboard Connector; Manufacturer: Hirose; DistPartNumber: FX10A-168P-SV(71)-ND; Board_Variant: ALL; Check Sch: CG_2015-03-03; Enclustra PN: EN100374; Geometry.Height: 4mm stack height; Distributor: Digikey; Package: SMD - 168pin Hirose; ROHS: Yes; Characteristics: -; Supplier: Enclustra; Check PCB: -; Cost: 4.50; ManufPartNumber: FX10A-168P-SV(71); Temperature: -55..+85°C; Type: Connector; Value: FX10A-168P-SV(71)
J3f = FPC12
R00f = RES
U2f = 8BitLevelShifter